# Altium project HeartBeat_v2.PrjPcb
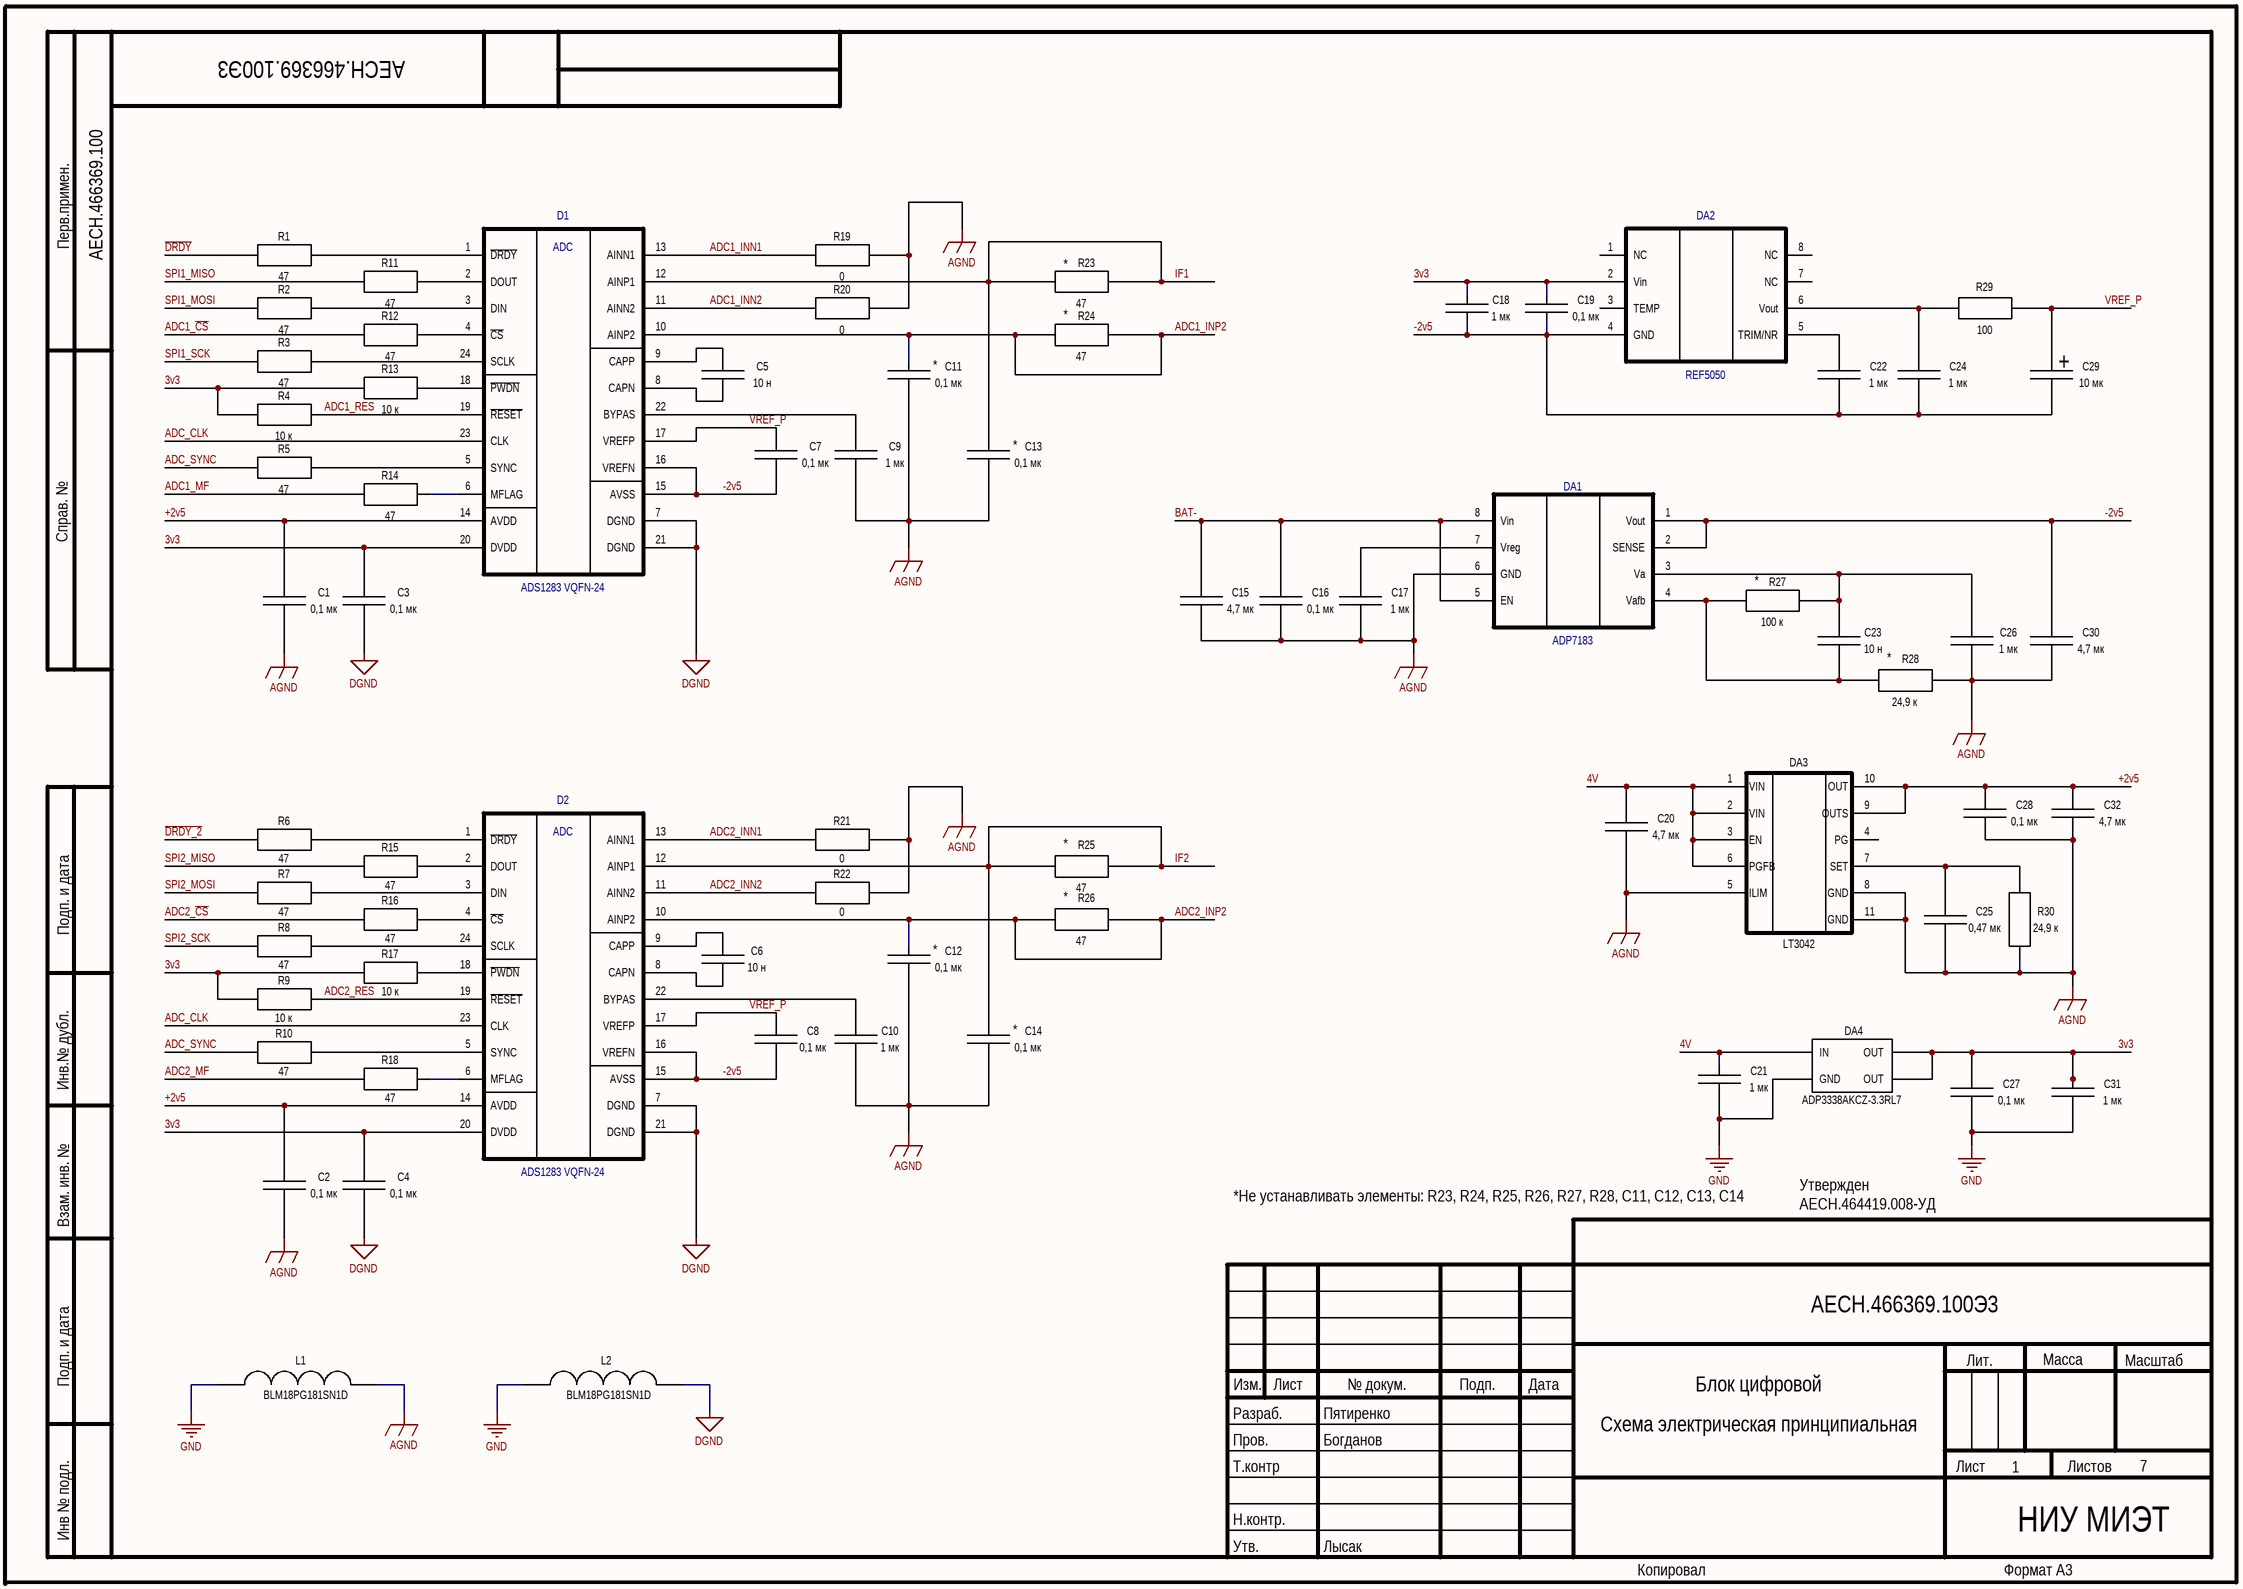
[diagram p0: ADC.SchDoc]
7 sheets, 223 parts. Net scope: global (net labels, ports and power ports of the same name join across sheets).
Board file: PCB1.PcbDoc
Sheets:
  ADC.SchDoc
  Connectors.SchDoc
  OTHER.SchDoc
  SDRAM.SchDoc
  MCU_1.SchDoc
  RES_ASSEMBLY.SchDoc
  MCU_Power.SchDoc

## Sheet ADC.SchDoc: Блок цифровой
size 420 x 297 mm; ApprovedBy: Лысак; CheckedBy: Богданов; Author: Пятиренко; CompanyName: нпг; DrawnBy: Человек; Organization: айцайц; DocumentNumber: АЕСН.466369.100Э3; SheetNumber: 1; SheetTotal: 7; PERVICH PRIM: АЕСН.466369.100; Title2: Схема электрическая принципиальная; DocumentName: Sheet1.SCHDOC; Application_BuildNumber: sdfsdfsdfsdfsdfs

### Parts
C1  value 0,1 мк  [C0603]  (hidden comment: C)
C2  value 0,1 мк  [C0603]  (hidden comment: C)
C3  value 0,1 мк  [C0603]  (hidden comment: C)
C4  value 0,1 мк  [C0603]  (hidden comment: C)
C5  value 10 н  [C0603]  (hidden comment: C)
C6  value 10 н  [C0603]  (hidden comment: C)
C7  value 0,1 мк  [C0603]  (hidden comment: C)
C8  value 0,1 мк  [C0603]  (hidden comment: C)
C9  value 1 мк  [C0603]  (hidden comment: C)
C10  value 1 мк  [C0603]  (hidden comment: C)
C11  value 0,1 мк  [C0603]  (hidden comment: C)
C12  value 0,1 мк  [C0603]  (hidden comment: C)
C13  value 0,1 мк  [C0603]  (hidden comment: C)
C14  value 0,1 мк  [C0603]  (hidden comment: C)
C15  value 4,7 мк  [C0603]  (hidden comment: C)
C16  value 0,1 мк  [C0603]  (hidden comment: C)
C17  value 1 мк  [C0603]  (hidden comment: C)
C18  value 1 мк  [C0603]  (hidden comment: C)
C19  value 0,1 мк  [C0603]  (hidden comment: C)
C20  value 4,7 мк  [C0603]  (hidden comment: C)
C21  value 1 мк  [C0603]  (hidden comment: C)
C22  value 1 мк  [C0603]  (hidden comment: C)
C23  value 10 н  [C0603]  (hidden comment: C)
C24  value 1 мк  [C0603]  (hidden comment: C)
C25  value 0,47 мк  [C0603]  (hidden comment: C)
C26  value 1 мк  [C0603]  (hidden comment: C)
C27  value 0,1 мк  [C0603]  (hidden comment: C)
C28  value 0,1 мк  [C0603]  (hidden comment: C)
C29  value 10 мк  [Case A]  (hidden comment: C_el)
C30  value 4,7 мк  [C0603]  (hidden comment: C)
C31  value 1 мк  [C0603]  (hidden comment: C)
C32  value 4,7 мк  [C0603]  (hidden comment: C)
D1  ADS1283 VQFN-24  [VQFN24_8x8x4x4]
D2  ADS1283 VQFN-24  [VQFN24_8x8x4x4]
DA1  ADP7183  [LFCSP-8]
DA2  REF5050  [SOIC8]
DA3  LT3042  [DFN-10 3x3]
DA4  ADP3338AKCZ-3.3RL7  [SOT-223]
L1  BLM18PG181SN1D  [INDC_0603]
L2  BLM18PG181SN1D  [INDC_0603]
R1  value 47  [R0603]  (hidden comment: R)
R2  value 47  [R0603]  (hidden comment: R)
R3  value 47  [R0603]  (hidden comment: R)
R4  value 10 к  [R0603]  (hidden comment: R)
R5  value 47  [R0603]  (hidden comment: R)
R6  value 47  [R0603]  (hidden comment: R)
R7  value 47  [R0603]  (hidden comment: R)
R8  value 47  [R0603]  (hidden comment: R)
R9  value 10 к  [R0603]  (hidden comment: R)
R10  value 47  [R0603]  (hidden comment: R)
R11  value 47  [R0603]  (hidden comment: R)
R12  value 47  [R0603]  (hidden comment: R)
R13  value 10 к  [R0603]  (hidden comment: R)
R14  value 47  [R0603]  (hidden comment: R)
R15  value 47  [R0603]  (hidden comment: R)
R16  value 47  [R0603]  (hidden comment: R)
R17  value 10 к  [R0603]  (hidden comment: R)
R18  value 47  [R0603]  (hidden comment: R)
R19  value 0  [R0603]  (hidden comment: R)
R20  value 0  [R0603]  (hidden comment: R)
R21  value 0  [R0603]  (hidden comment: R)
R22  value 0  [R0603]  (hidden comment: R)
R23  value 47  [R0603]  (hidden comment: R)
R24  value 47  [R0603]  (hidden comment: R)
R25  value 47  [R0603]  (hidden comment: R)
R26  value 47  [R0603]  (hidden comment: R)
R27  value 100 к  [R0603]  (hidden comment: R)
R28  value 24,9 к  [R0603]  (hidden comment: R)
R29  value 100  [R0603]  (hidden comment: R)
R30  value 24,9 к  [R0603]  (hidden comment: R)

### Nets
AGND: C1.2 C2.2 C9.2 C10.2 C11.2 C12.2 C13.2 C14.2 C15.2 C16.2 C17.2 C20.2 C25.2 C26.2 C28.2 C30.2 C32.2 DA1.6(GND) DA3.5(ILIM) DA3.8(GND) DA3.11(GND) L1.1 R19.2 R20.2 R21.2 R22.2 R28.2 R30.1
DGND: C3.2 C4.2 D1.7(DGND) D1.21(DGND) D2.7(DGND) D2.21(DGND) L2.1
GND: C21.2 C27.2 C31.2 DA4.1(GND) L1.2 L2.2
3v3: C3.1 C4.1 C18.1 C19.1 C27.1 C31.1 D1.20(DVDD) D2.20(DVDD) DA2.2(Vin) DA4.2(OUT) DA4.4(OUT) R4.1 R9.1 R13.1 R17.1
4V: C20.1 C21.1 DA3.1(VIN) DA3.2(VIN) DA3.3(EN) DA3.6(PGFB) DA4.3(IN)
+2v5: C1.1 C2.1 C28.1 C32.1 D1.14(AVDD) D2.14(AVDD) DA3.9(OUTS) DA3.10(OUT)
-2v5: C7.2 C8.2 C18.2 C19.2 C22.2 C24.2 C29.2 C30.1 D1.15(AVSS) D1.16(VREFN) D2.15(AVSS) D2.16(VREFN) DA1.1(Vout) DA1.2(SENSE) DA2.4(GND)
ADC1_~{CS}: R12.1
ADC1_INN1: D1.13(AINN1) R19.1
ADC1_INN2: D1.11(AINN2) R20.1
ADC1_INP2: C11.1 D1.10(AINP2) R24.1 R24.2
ADC1_MF: R14.1
ADC1_RES: D1.19(~{RESET}) R4.2
ADC2_~{CS}: R16.1
ADC2_INN1: D2.13(AINN1) R21.1
ADC2_INN2: D2.11(AINN2) R22.1
ADC2_INP2: C12.1 D2.10(AINP2) R26.1 R26.2
ADC2_MF: R18.1
ADC2_RES: D2.19(~{RESET}) R9.2
ADC_CLK: D1.23(CLK) D2.23(CLK)
ADC_SYNC: R5.1 R10.1
BAT-: C15.1 C16.1 DA1.5(EN) DA1.8(Vin)
~{DRDY}: R1.1
~{DRDY_2}: R6.1
IF1: C13.1 D1.12(AINP1) R23.1 R23.2
IF2: C14.1 D2.12(AINP1) R25.1 R25.2
SPI1_MISO: R11.1
SPI1_MOSI: R2.1
SPI1_SCK: R3.1
SPI2_MISO: R15.1
SPI2_MOSI: R7.1
SPI2_SCK: R8.1
VREF_P: C7.1 C8.1 C29.1 D1.17(VREFP) D2.17(VREFP) R29.2
NetC5_1: C5.1 D1.8(CAPN)
NetC5_2: C5.2 D1.9(CAPP)
NetC6_1: C6.1 D2.8(CAPN)
NetC6_2: C6.2 D2.9(CAPP)
NetC9_1: C9.1 D1.22(BYPAS)
NetC10_1: C10.1 D2.22(BYPAS)
NetC17_1: C17.1 DA1.7(Vreg)
NetC22_1: C22.1 DA2.5(TRIM/NR)
NetC23_1: C23.1 DA1.4(Vafb) R27.1 R28.1
NetC23_2: C23.2 C26.1 DA1.3(Va) R27.2
NetC24_1: C24.1 DA2.6(Vout) R29.1
NetC25_1: C25.1 DA3.7(SET) R30.2
NetD1_1: D1.1(~{DRDY}) R1.2
NetD1_2: D1.2(DOUT) R11.2
NetD1_3: D1.3(DIN) R2.2
NetD1_4: D1.4(~{CS}) R12.2
NetD1_5: D1.5(SYNC) R5.2
NetD1_6: D1.6(MFLAG) R14.2
NetD1_18: D1.18(~{PWDN}) R13.2
NetD1_24: D1.24(SCLK) R3.2
NetD2_1: D2.1(~{DRDY}) R6.2
NetD2_2: D2.2(DOUT) R15.2
NetD2_3: D2.3(DIN) R7.2
NetD2_4: D2.4(~{CS}) R16.2
NetD2_5: D2.5(SYNC) R10.2
NetD2_6: D2.6(MFLAG) R18.2
NetD2_18: D2.18(~{PWDN}) R17.2
NetD2_24: D2.24(SCLK) R8.2

Not connected (* = marked no-connect by the designer): DA2 1(NC) 3(TEMP) 7(NC) 8(NC); DA3 4(PG)

### Notes on the sheet
- (near R23) *
- (near R24) *
- (near C11) *
- (near C13) *
- (near R27) *
- (near R28) *
- (near R25) *
- *
- (near C12) *
- (near C14) *
- *Не устанавливать элементы: R23, R24, R25, R26, R27, R28, C11, C12, C13, C14
- Утвержден
- АЕСН.464419.008-УД
- НИУ МИЭТ
- Перв.примен.
- Справ. №
- Подп. и дата
- Инв.№ дубл.
- Взам. инв. №
- Изм.
- Лист
- № докум.
- Подп.
- Дата
- Лит.
- Масса
- Масштаб
- Пров.
- Т.контр
- Разраб.
- Листов
- Инв № подл.
- Н.контр.
- Утв.
- Копировал
- Формат А3
- (in symbol ADS1283) ADC
- (in symbol C_el) +

### Library data of the parts
C1-C4 C7 C8 C11-C14 C16 C19 C27 C28 = C: PartNumber: GRM188R71H104KA93D; Tolerance: ±10%; Voltage: 50 В; Dielectric: X7R; Case: 0603
  C1-C4 C7 C8 C16 C19 C27 C28: Mount: *
C5 C6 C23 = C: PartNumber: GRM188R72A103KA01J; Tolerance: ±10%; Voltage: 100В; Dielectric: X7R; Case: 0603; Mount: *
C9 C10 C17 C18 C21 C22 C24 C26 C31 = C: PartNumber: GRM188R71E105KA12D; Tolerance: ±10%; Voltage: 25 В; Dielectric: X7R; Case: 0603; Mount: *
C15 C20 C30 C32 = C: PartNumber: GRM188Z71C475KE21D; Tolerance: ±10%; Voltage: 16 В; Dielectric: X7R; Case: 0603; Mount: *
C25 = C: PartNumber: GRM188R71E474KA12D; Tolerance: ±10%; Voltage: 25 В; Dielectric: X7R; Case: 0603; Mount: *
C29 = C_el: PartNumber: TAJA106K016RNJ; Tolerance: ±10%; Voltage: 16 V; Dielectric: *; Case: "A"; Mount: *
D1 D2 = ADS1283: ADC 2ch
DA2 = REF50xx
DA4 = LD1117S33
L1 L2 = L_1
R1-R3 R5-R8 R10-R12 R14-R16 R18 R23-R26 = R: PartNumber: RC0603JR-0747RL; Tolerance: ±5%; Power: 0.1 Вт; Case: 0603
R4 R9 R13 R17 = R: PartNumber: RC0603JR-0710KL; Tolerance: ±5%; Power: 0.1 Вт; Case: 0603
R19-R22 = R: PartNumber: RC0603JR-070RL; Tolerance: ±5%; Power: 0.1 Вт; Case: 0603
R27 = R: PartNumber: RC0603FR-07100KL; Tolerance: ±1%; Power: 0.1 Вт; Case: 0603
R28 R30 = R: PartNumber: RC0603FR-0724K9L; Tolerance: ±1%; Power: 0.1 Вт; Case: 0603
R29 = R: PartNumber: RC0603JR-07100RL; Tolerance: ±5%; Power: 0.1 Вт; Case: 0603

## Sheet Connectors.SchDoc
size 420 x 297 mm; DocumentNumber: АЕСН.466369.100Э3; SheetNumber: 2; SheetTotal: x; DocumentName: Sheet1.SCHDOC
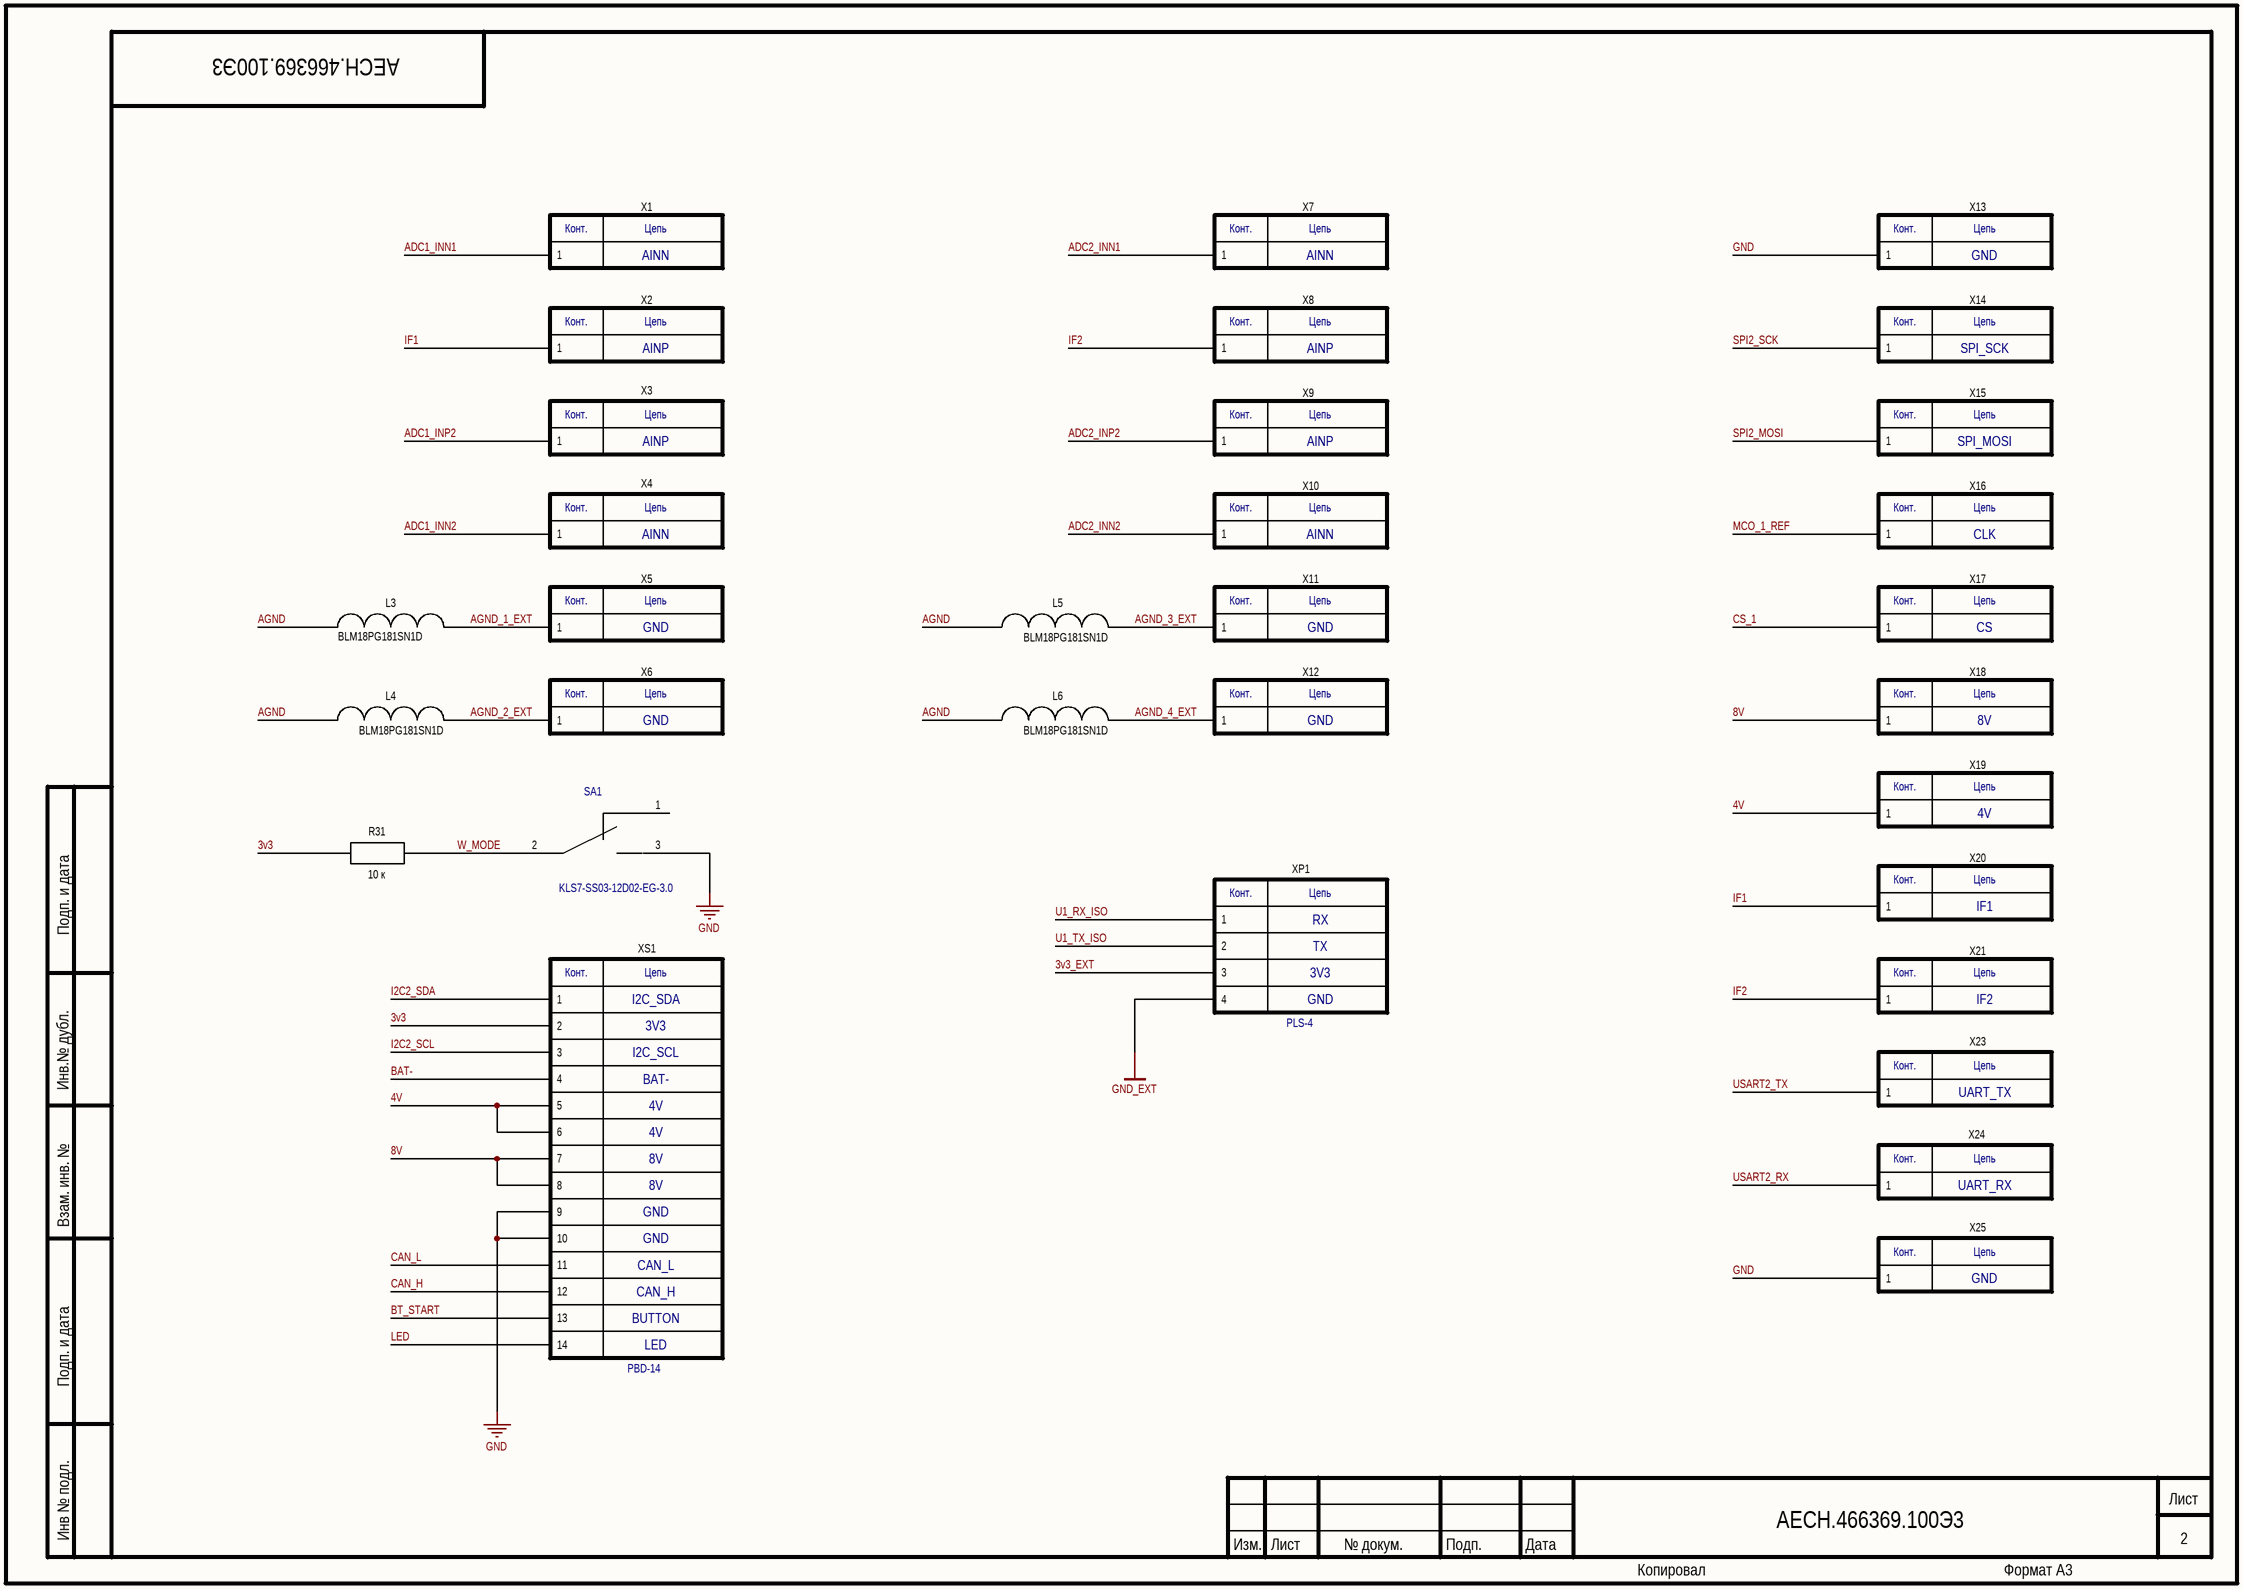
[diagram p1: Connectors.SchDoc]

### Parts
L3  BLM18PG181SN1D  [INDC_0603]
L4  BLM18PG181SN1D  [INDC_0603]
L5  BLM18PG181SN1D  [INDC_0603]
L6  BLM18PG181SN1D  [INDC_0603]
R31  value 10 к  [R0603]  (hidden comment: R)
SA1  PartNumber: KLS7-SS03-12D02-EG-3.0  [KLS7-SS03-12D02]  (hidden comment: Switch)
X1  1pin  [lam 4x2]  (value not drawn)
X2  1pin  [lam 4x2]  (value not drawn)
X3  1pin  [lam 4x2]  (value not drawn)
X4  1pin  [lam 4x2]  (value not drawn)
X5  1pin  [lam 4x2]  (value not drawn)
X6  1pin  [lam 4x2]  (value not drawn)
X7  1pin  [lam 4x2]  (value not drawn)
X8  1pin  [lam 4x2]  (value not drawn)
X9  1pin  [lam 4x2]  (value not drawn)
X10  1pin  [lam 4x2]  (value not drawn)
X11  1pin  [lam 4x2]  (value not drawn)
X12  1pin  [lam 4x2]  (value not drawn)
X13  1pin  [lam 4x2]  (value not drawn)
X14  1pin  [lam 4x2]  (value not drawn)
X15  1pin  [lam 4x2]  (value not drawn)
X16  1pin  [lam 4x2]  (value not drawn)
X17  1pin  [lam 4x2]  (value not drawn)
X18  1pin  [lam 4x2]  (value not drawn)
X19  1pin  [lam 4x2]  (value not drawn)
X20  1pin  [lam 4x2]  (value not drawn)
X21  1pin  [lam 4x2]  (value not drawn)
X23  1pin  [lam 4x2]  (value not drawn)
X24  1pin  [lam 4x2]  (value not drawn)
X25  1pin  [lam 4x2]  (value not drawn)
XP1  4pin  [PLS-4]  (value not drawn)
XS1  14pin  [PBD-14]  (value not drawn)

### Nets
AGND: L3.2 L4.2 L5.2 L6.2
GND: SA1.3 X13.1 X25.1 XS1.9 XS1.10
GND_EXT: XP1.4
3v3: R31.1 XS1.2
3v3_EXT: XP1.3
4V: X19.1 XS1.5 XS1.6
8V: X18.1 XS1.7 XS1.8
ADC1_INN1: X1.1
ADC1_INN2: X4.1
ADC1_INP2: X3.1
ADC2_INN1: X7.1
ADC2_INN2: X10.1
ADC2_INP2: X9.1
AGND_1_EXT: L3.1 X5.1
AGND_2_EXT: L4.1 X6.1
AGND_3_EXT: L5.1 X11.1
AGND_4_EXT: L6.1 X12.1
BAT-: XS1.4
BT_START: XS1.13
CAN_H: XS1.12
CAN_L: XS1.11
CS_1: X17.1
I2C2_SCL: XS1.3
I2C2_SDA: XS1.1
IF1: X2.1 X20.1
IF2: X8.1 X21.1
LED: XS1.14
MCO_1_REF: X16.1
SPI2_MOSI: X15.1
SPI2_SCK: X14.1
U1_RX_ISO: XP1.1
U1_TX_ISO: XP1.2
USART2_RX: X24.1
USART2_TX: X23.1
W_MODE: R31.2 SA1.2

Not connected (* = marked no-connect by the designer): SA1 1

### Notes on the sheet
- AINN
- GND
- AINP
- SPI_SCK
- SPI_MOSI
- CLK
- CS
- 8V
- 4V
- RX
- IF1
- I2C_SDA
- TX
- 3V3
- IF2
- I2C_SCL
- BAT-
- UART_TX
- UART_RX
- CAN_L
- CAN_H
- BUTTON
- LED
- Подп. и дата
- Инв.№ дубл.
- Взам. инв. №
- Инв № подл.
- Изм.
- Лист
- № докум.
- Подп.
- Дата
- Копировал
- Формат А3
- (in symbol 1pin) Конт.; Цепь
- (in symbol 4pin) Конт.; Цепь
- (in symbol 14pin) Конт.; Цепь

### Library data of the parts
L3-L6 = L_1
R31 = R: as R4 on sheet ADC; Case: 0603
SA1 = Switch: Manufacturer: *
X1-X21 X23-X25 = 1pin: Manufacturer: *; PartNumber: *
XP1 = 4pin: Manufacturer: *; PartNumber: PLS-4
XS1 = 14pin: Manufacturer: *; PartNumber: PBD-14

## Sheet OTHER.SchDoc
size 420 x 297 mm; DocumentNumber: АЕСН.466369.100Э3; SheetNumber: 3; SheetTotal: x; DocumentName: Sheet1.SCHDOC
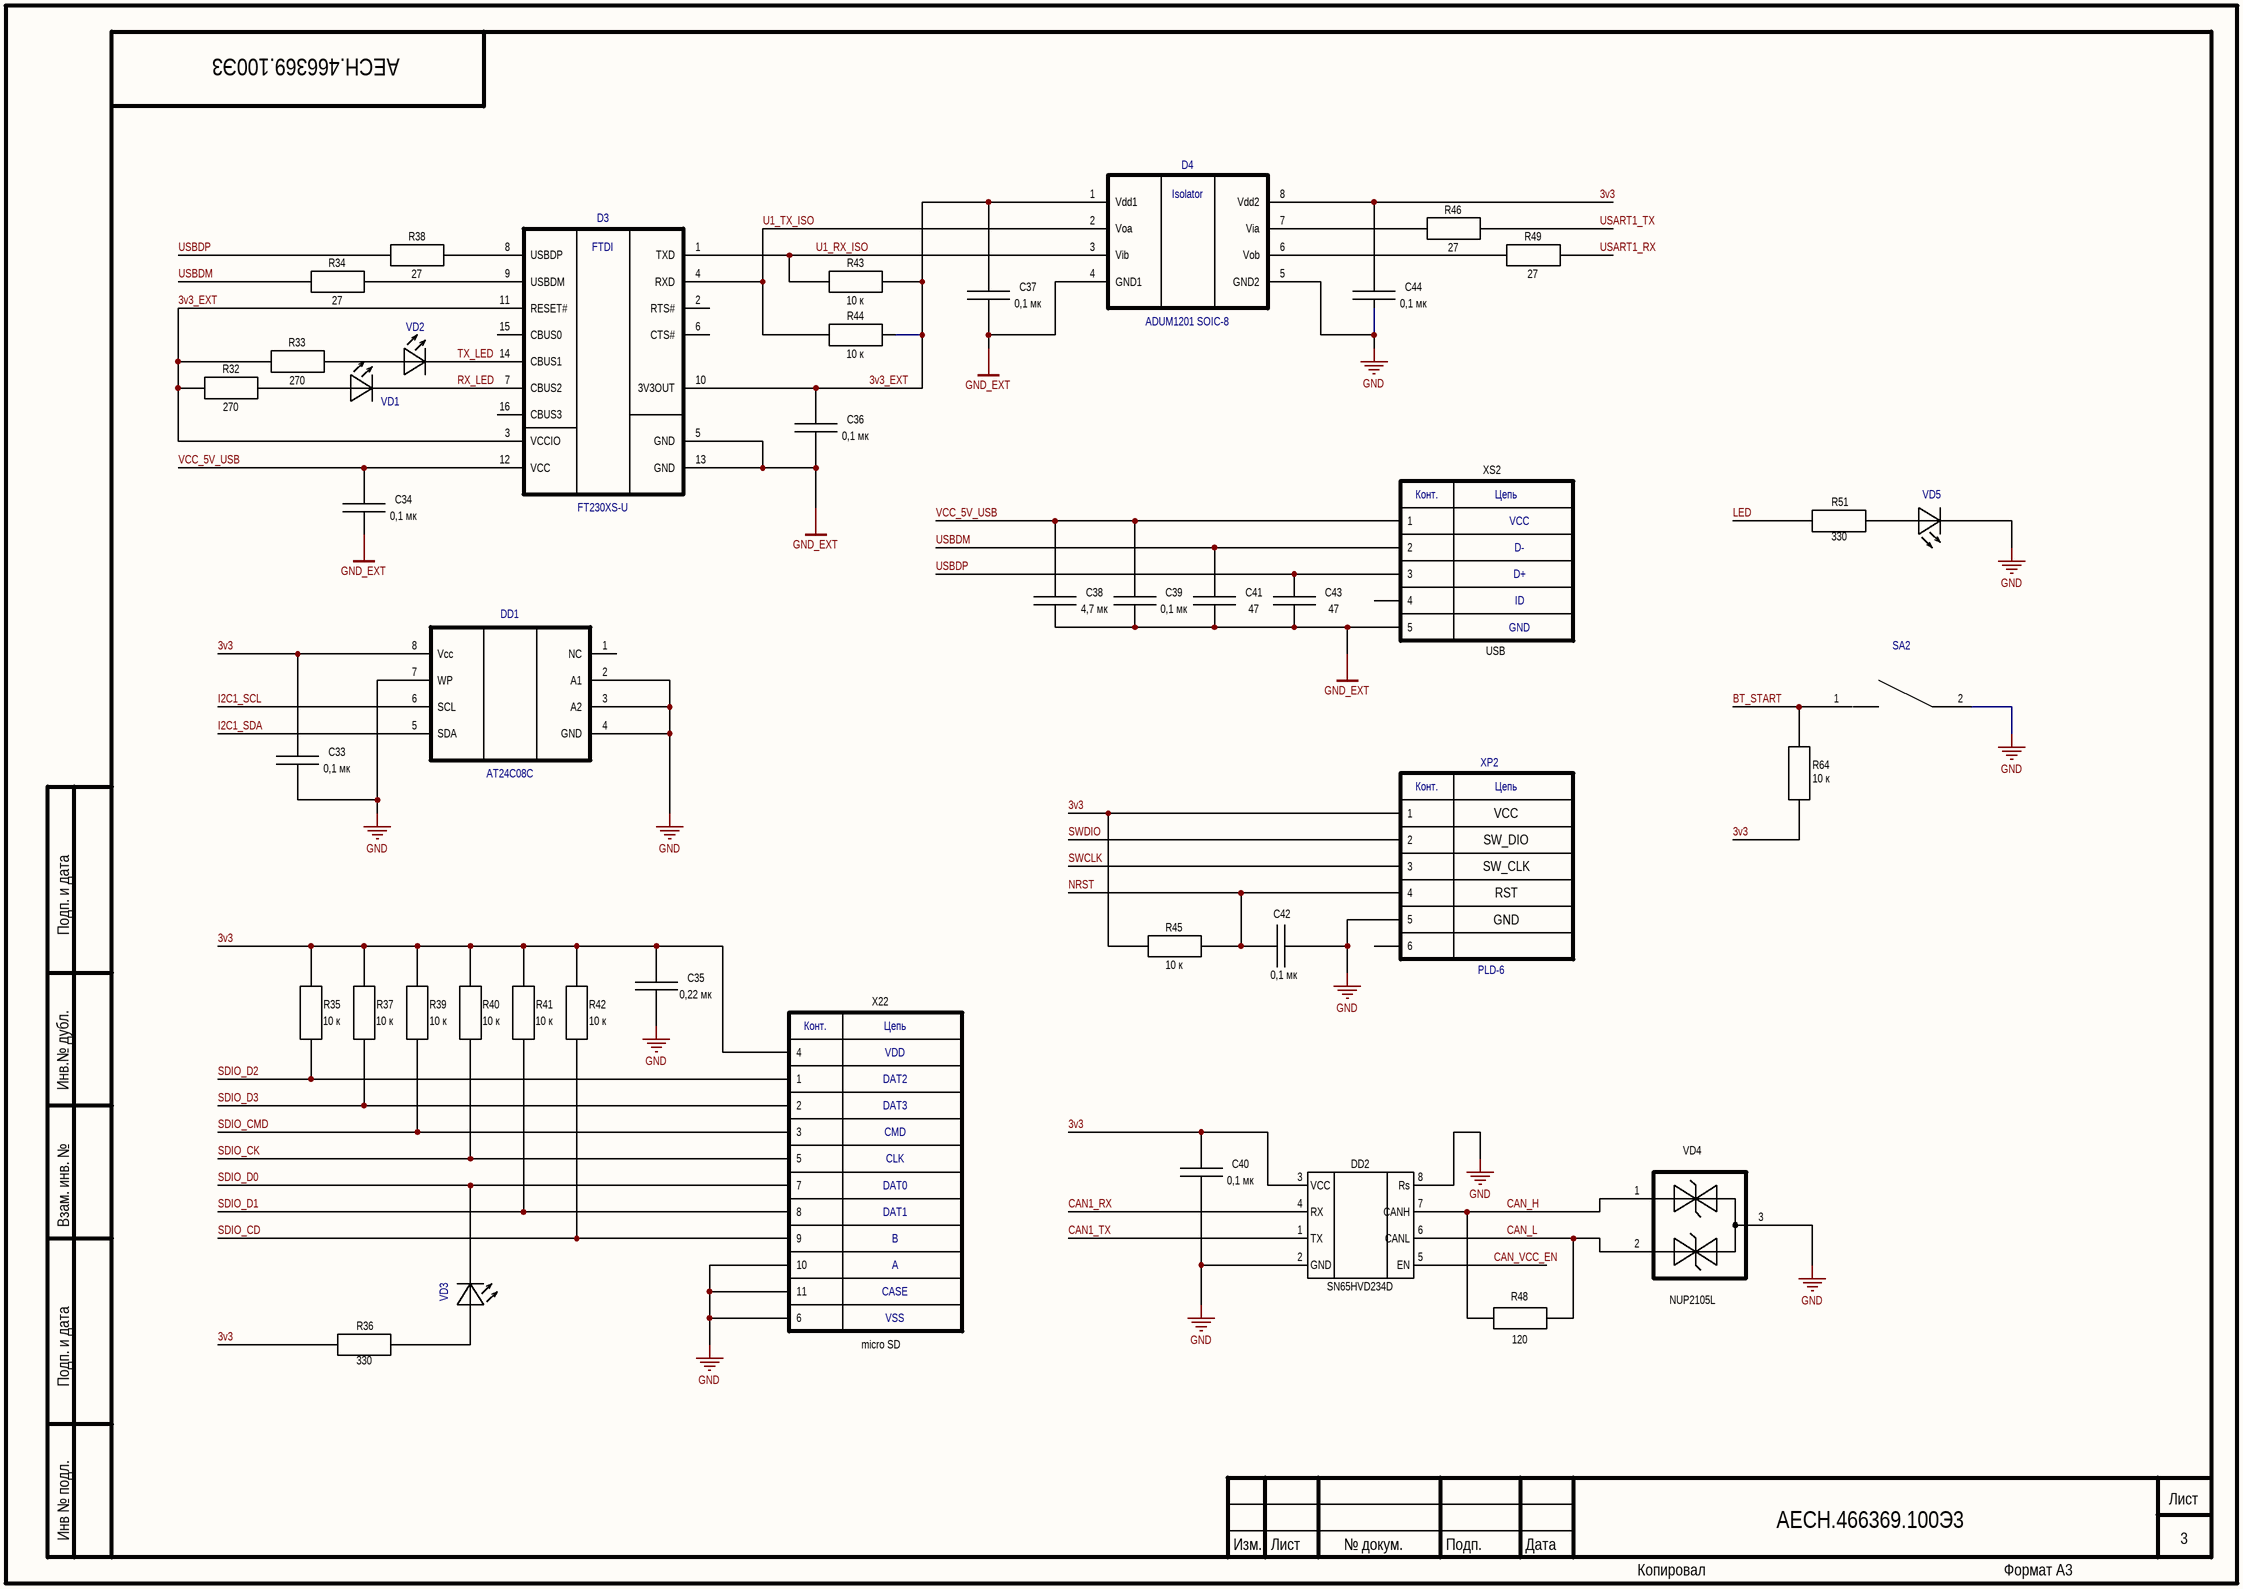
[diagram p2: OTHER.SchDoc]

### Parts
C33  value 0,1 мк  [C0603]  (hidden comment: C)
C34  value 0,1 мк  [C0603]  (hidden comment: C)
C35  value 0,22 мк  [C0603]  (hidden comment: C)
C36  value 0,1 мк  [C0603]  (hidden comment: C)
C37  value 0,1 мк  [C0603]  (hidden comment: C)
C38  value 4,7 мк  [C0603]  (hidden comment: C)
C39  value 0,1 мк  [C0603]  (hidden comment: C)
C40  value 0,1 мк  [C0603]  (hidden comment: C)
C41  value 47  [C0603]  (hidden comment: C)
C42  value 0,1 мк  [C0603]  (hidden comment: C)
C43  value 47  [C0603]  (hidden comment: C)
C44  value 0,1 мк  [C0603]  (hidden comment: C)
D3  FT230XS-U  [SSOP-16]
D4  ADUM1201 SOIC-8  [SOIC8]
DD1  AT24C08C  [SOIC8]
DD2  SN65HVD234D  [SOIC8]
R32  value 270  [R0603]  (hidden comment: R)
R33  value 270  [R0603]  (hidden comment: R)
R34  value 27  [R0603]  (hidden comment: R)
R35  value 10 к  [R0603]  (hidden comment: R)
R36  value 330  [R0603]  (hidden comment: R)
R37  value 10 к  [R0603]  (hidden comment: R)
R38  value 27  [R0603]  (hidden comment: R)
R39  value 10 к  [R0603]  (hidden comment: R)
R40  value 10 к  [R0603]  (hidden comment: R)
R41  value 10 к  [R0603]  (hidden comment: R)
R42  value 10 к  [R0603]  (hidden comment: R)
R43  value 10 к  [R0603]  (hidden comment: R)
R44  value 10 к  [R0603]  (hidden comment: R)
R45  value 10 к  [R0603]  (hidden comment: R)
R46  value 27  [R0603]  (hidden comment: R)
R48  value 120  [R1206]  (hidden comment: R)
R49  value 27  [R0603]  (hidden comment: R)
R51  value 330  [R0603]  (hidden comment: R)
R64  value 10 к  [R0603]  (hidden comment: R)
SA2  Button  [KLS7_6x6]  (value not drawn)
VD1  LED  [LED_0603_YELLOW]  (value not drawn)
VD2  LED  [LED_0603_GREEN]  (value not drawn)
VD3  LED  [LED_0603_BLUE]  (value not drawn)
VD4  NUP2105L  [SOT-23]
VD5  LED  [LED_0603_RED]  (value not drawn)
X22  micro SD  [DM3AT-SF-PEJM5]
XP2  PLD-6  [PLD-6]
XS2  USB  [USB_MICRO_1981568-1]

### Nets
GND: C33.2 C35.2 C40.2 C42.2 C44.2 D4.5(GND2) DD1.2(A1) DD1.3(A2) DD1.4(GND) DD1.7(WP) DD2.2(GND) DD2.8(Rs) SA2.2 VD4.3(AC) VD5.2(C) X22.6 X22.10 X22.11 XP2.5
GND_EXT: C34.2 C36.2 C37.2 C38.2 C39.2 C41.2 C43.2 D3.5(GND) D3.13(GND) D4.4(GND1) XS2.5
3v3: C33.1 C35.1 C40.1 C44.1 D4.8(Vdd2) DD1.8(Vcc) DD2.3(VCC) R35.2 R36.2 R37.2 R39.2 R40.2 R41.2 R42.2 R45.1 R64.1 X22.4 XP2.1
3v3_EXT: C36.1 C37.1 D3.3(VCCIO) D3.10(3V3OUT) D3.11(RESET#) D4.1(Vdd1) R32.1 R33.1 R43.2 R44.2
BT_START: R64.2 SA2.1
CAN1_RX: DD2.4(RX)
CAN1_TX: DD2.1(TX)
CAN_H: DD2.7(CANH) R48.1 VD4.1(A)
CAN_L: DD2.6(CANL) R48.2 VD4.2(C)
CAN_VCC_EN: DD2.5(EN)
I2C1_SCL: DD1.6(SCL)
I2C1_SDA: DD1.5(SDA)
LED: R51.2
NRST: C42.1 R45.2 XP2.4
RX_LED: D3.7(CBUS2) VD1.2(C)
SDIO_CD: R42.1 X22.9
SDIO_CK: R40.1 X22.5
SDIO_CMD: R39.1 X22.3
SDIO_D0: VD3.2(C) X22.7
SDIO_D1: R41.1 X22.8
SDIO_D2: R35.1 X22.1
SDIO_D3: R37.1 X22.2
SWCLK: XP2.3
SWDIO: XP2.2
TX_LED: D3.14(CBUS1) VD2.2(C)
U1_RX_ISO: D3.1(TXD) D4.3(Vib) R43.1
U1_TX_ISO: D3.4(RXD) D4.2(Voa) R44.1
USART1_RX: R49.2
USART1_TX: R46.2
USBDM: C41.1 R34.1 XS2.2
USBDP: C43.1 R38.1 XS2.3
VCC_5V_USB: C34.1 C38.1 C39.1 D3.12(VCC) XS2.1
NetD3_8: D3.8(USBDP) R38.2
NetD3_9: D3.9(USBDM) R34.2
NetD4_6: D4.6(Vob) R49.1
NetD4_7: D4.7(Via) R46.1
NetR32_2: R32.2 VD1.1(A)
NetR33_2: R33.2 VD2.1(A)
NetR36_1: R36.1 VD3.1(A)
NetR51_1: R51.1 VD5.1(A)

Not connected (* = marked no-connect by the designer): D3 2(RTS#) 6(CTS#) 15(CBUS0) 16(CBUS3); DD1 1(NC); XP2 6; XS2 4

### Notes on the sheet
- VCC
- SW_DIO
- SW_CLK
- RST
- GND
- Подп. и дата
- Инв.№ дубл.
- Взам. инв. №
- Инв № подл.
- Изм.
- Лист
- № докум.
- Подп.
- Дата
- Копировал
- Формат А3
- (in symbol 6pin) Конт.; Цепь
- (in symbol ADUM1201) Isolator
- (in symbol FT230XS-U) FTDI
- (in symbol microSD) Конт.; Цепь; VDD; DAT2; DAT3; CMD; CLK; DAT0; DAT1; B; A; CASE; VSS
- (in symbol USB) Конт.; Цепь; VCC; D-; D+; ID; GND

### Library data of the parts
C33 C34 C36 C37 C39 C40 C42 C44 = C: as C1 on sheet ADC; Case: 0603; Mount: *
C35 = C: PartNumber: GRM188R71E224KA88D; Tolerance: ±10%; Voltage: 25 В; Dielectric: X7R; Case: 0603; Mount: *
C38 = C: as C15 on sheet ADC; Case: 0603; Mount: *
C41 C43 = C: PartNumber: GRM1885C1H470FA01D; Tolerance: ±10%; Voltage: 50 В; Dielectric: NP0; Case: 0603; Mount: *
D4 = ADUM1201
DD1 = AT24C0xC
DD2 = SN65HVD234D: CAN
R32 R33 = R: PartNumber: RC0603JR-07270RL; Tolerance: ±5%; Power: 0.1 Вт; Case: 0603
R34 R38 R46 R49 = R: PartNumber: RC0603JR-0727RL; Tolerance: ±5%; Power: 0.1 Вт; Case: 0603
R35 R37 R39-R45 R64 = R: as R4 on sheet ADC; Case: 0603
R36 R51 = R: PartNumber: RC0603JR-07330RL; Tolerance: ±5%; Power: 0.1 Вт; Case: 0603
R48 = R: PartNumber: RC1206JR-13120RL; Tolerance: ±5%; Power: 0.25 Вт; Case: 1206
X22 = microSD
XP2 = 6pin: Manufacturer: *; PartNumber: PLD-6

## Sheet SDRAM.SchDoc
size 420 x 297 mm; DocumentNumber: АЕСН.466369.100Э3; SheetNumber: 4; SheetTotal: x; DocumentName: Sheet1.SCHDOC
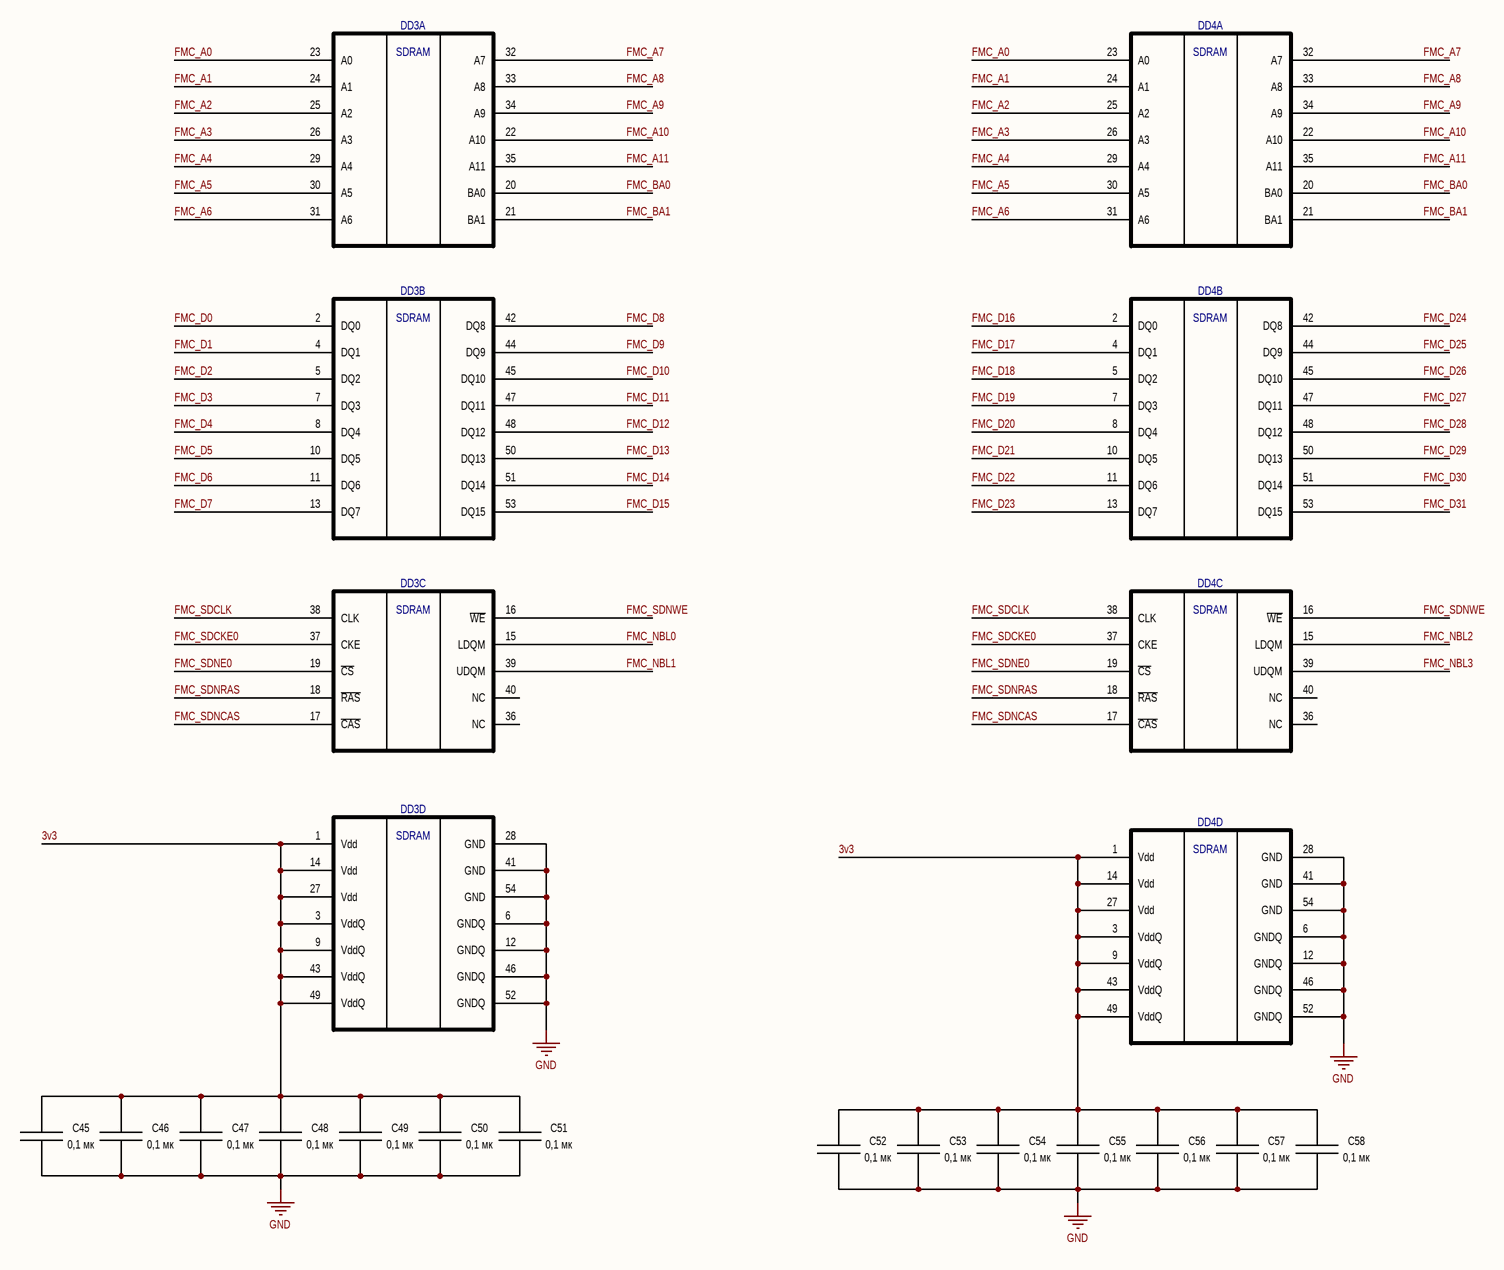
[diagram p3: SDRAM.SchDoc]

### Parts
C45  value 0,1 мк  [C0603]  (hidden comment: C)
C46  value 0,1 мк  [C0603]  (hidden comment: C)
C47  value 0,1 мк  [C0603]  (hidden comment: C)
C48  value 0,1 мк  [C0603]  (hidden comment: C)
C49  value 0,1 мк  [C0603]  (hidden comment: C)
C50  value 0,1 мк  [C0603]  (hidden comment: C)
C51  value 0,1 мк  [C0603]  (hidden comment: C)
C52  value 0,1 мк  [C0603]  (hidden comment: C)
C53  value 0,1 мк  [C0603]  (hidden comment: C)
C54  value 0,1 мк  [C0603]  (hidden comment: C)
C55  value 0,1 мк  [C0603]  (hidden comment: C)
C56  value 0,1 мк  [C0603]  (hidden comment: C)
C57  value 0,1 мк  [C0603]  (hidden comment: C)
C58  value 0,1 мк  [C0603]  (hidden comment: C)
DD3  IS42S16400J  [TSOP-54]  (value not drawn)  (parts A,B,C,D of 4)
DD4  IS42S16400J  [TSOP-54]  (value not drawn)  (parts A,B,C,D of 4)

### Nets
GND: C45.2 C46.2 C47.2 C48.2 C49.2 C50.2 C51.2 C52.2 C53.2 C54.2 C55.2 C56.2 C57.2 C58.2 DD3.6(GNDQ) DD3.12(GNDQ) DD3.28(GND) DD3.41(GND) DD3.46(GNDQ) DD3.52(GNDQ) DD3.54(GND) DD4.6(GNDQ) DD4.12(GNDQ) DD4.28(GND) DD4.41(GND) DD4.46(GNDQ) DD4.52(GNDQ) DD4.54(GND)
3v3: C45.1 C46.1 C47.1 C48.1 C49.1 C50.1 C51.1 C52.1 C53.1 C54.1 C55.1 C56.1 C57.1 C58.1 DD3.1(Vdd) DD3.3(VddQ) DD3.9(VddQ) DD3.14(Vdd) DD3.27(Vdd) DD3.43(VddQ) DD3.49(VddQ) DD4.1(Vdd) DD4.3(VddQ) DD4.9(VddQ) DD4.14(Vdd) DD4.27(Vdd) DD4.43(VddQ) DD4.49(VddQ)
FMC_A0: DD3.23(A0) DD4.23(A0)
FMC_A1: DD3.24(A1) DD4.24(A1)
FMC_A2: DD3.25(A2) DD4.25(A2)
FMC_A3: DD3.26(A3) DD4.26(A3)
FMC_A4: DD3.29(A4) DD4.29(A4)
FMC_A5: DD3.30(A5) DD4.30(A5)
FMC_A6: DD3.31(A6) DD4.31(A6)
FMC_A7: DD3.32(A7) DD4.32(A7)
FMC_A8: DD3.33(A8) DD4.33(A8)
FMC_A9: DD3.34(A9) DD4.34(A9)
FMC_A10: DD3.22(A10) DD4.22(A10)
FMC_A11: DD3.35(A11) DD4.35(A11)
FMC_BA0: DD3.20(BA0) DD4.20(BA0)
FMC_BA1: DD3.21(BA1) DD4.21(BA1)
FMC_D0: DD3.2(DQ0)
FMC_D1: DD3.4(DQ1)
FMC_D2: DD3.5(DQ2)
FMC_D3: DD3.7(DQ3)
FMC_D4: DD3.8(DQ4)
FMC_D5: DD3.10(DQ5)
FMC_D6: DD3.11(DQ6)
FMC_D7: DD3.13(DQ7)
FMC_D8: DD3.42(DQ8)
FMC_D9: DD3.44(DQ9)
FMC_D10: DD3.45(DQ10)
FMC_D11: DD3.47(DQ11)
FMC_D12: DD3.48(DQ12)
FMC_D13: DD3.50(DQ13)
FMC_D14: DD3.51(DQ14)
FMC_D15: DD3.53(DQ15)
FMC_D16: DD4.2(DQ0)
FMC_D17: DD4.4(DQ1)
FMC_D18: DD4.5(DQ2)
FMC_D19: DD4.7(DQ3)
FMC_D20: DD4.8(DQ4)
FMC_D21: DD4.10(DQ5)
FMC_D22: DD4.11(DQ6)
FMC_D23: DD4.13(DQ7)
FMC_D24: DD4.42(DQ8)
FMC_D25: DD4.44(DQ9)
FMC_D26: DD4.45(DQ10)
FMC_D27: DD4.47(DQ11)
FMC_D28: DD4.48(DQ12)
FMC_D29: DD4.50(DQ13)
FMC_D30: DD4.51(DQ14)
FMC_D31: DD4.53(DQ15)
FMC_NBL0: DD3.15(LDQM)
FMC_NBL1: DD3.39(UDQM)
FMC_NBL2: DD4.15(LDQM)
FMC_NBL3: DD4.39(UDQM)
FMC_SDCKE0: DD3.37(CKE) DD4.37(CKE)
FMC_SDCLK: DD3.38(CLK) DD4.38(CLK)
FMC_SDNCAS: DD3.17(~{CAS}) DD4.17(~{CAS})
FMC_SDNE0: DD3.19(~{CS}) DD4.19(~{CS})
FMC_SDNRAS: DD3.18(~{RAS}) DD4.18(~{RAS})
FMC_SDNWE: DD3.16(~{WE}) DD4.16(~{WE})

Not connected (* = marked no-connect by the designer): DD3 36(NC) 40(NC); DD4 36(NC) 40(NC)

### Notes on the sheet
- Подп. и дата
- Инв.№ дубл.
- Взам. инв. №
- Инв № подл.
- Изм.
- Лист
- № докум.
- Подп.
- Дата
- Копировал
- Формат А3
- (in symbol IS42S16400J, part A) SDRAM
- (in symbol IS42S16400J, part B) SDRAM
- (in symbol IS42S16400J, part C) SDRAM
- (in symbol IS42S16400J, part D) SDRAM

### Library data of the parts
C45-C58 = C: as C1 on sheet ADC; Case: 0603; Mount: *

## Sheet MCU_1.SchDoc
size 420 x 297 mm; DocumentNumber: АЕСН.466369.100Э3; SheetNumber: 5; SheetTotal: x; DocumentName: Sheet1.SCHDOC
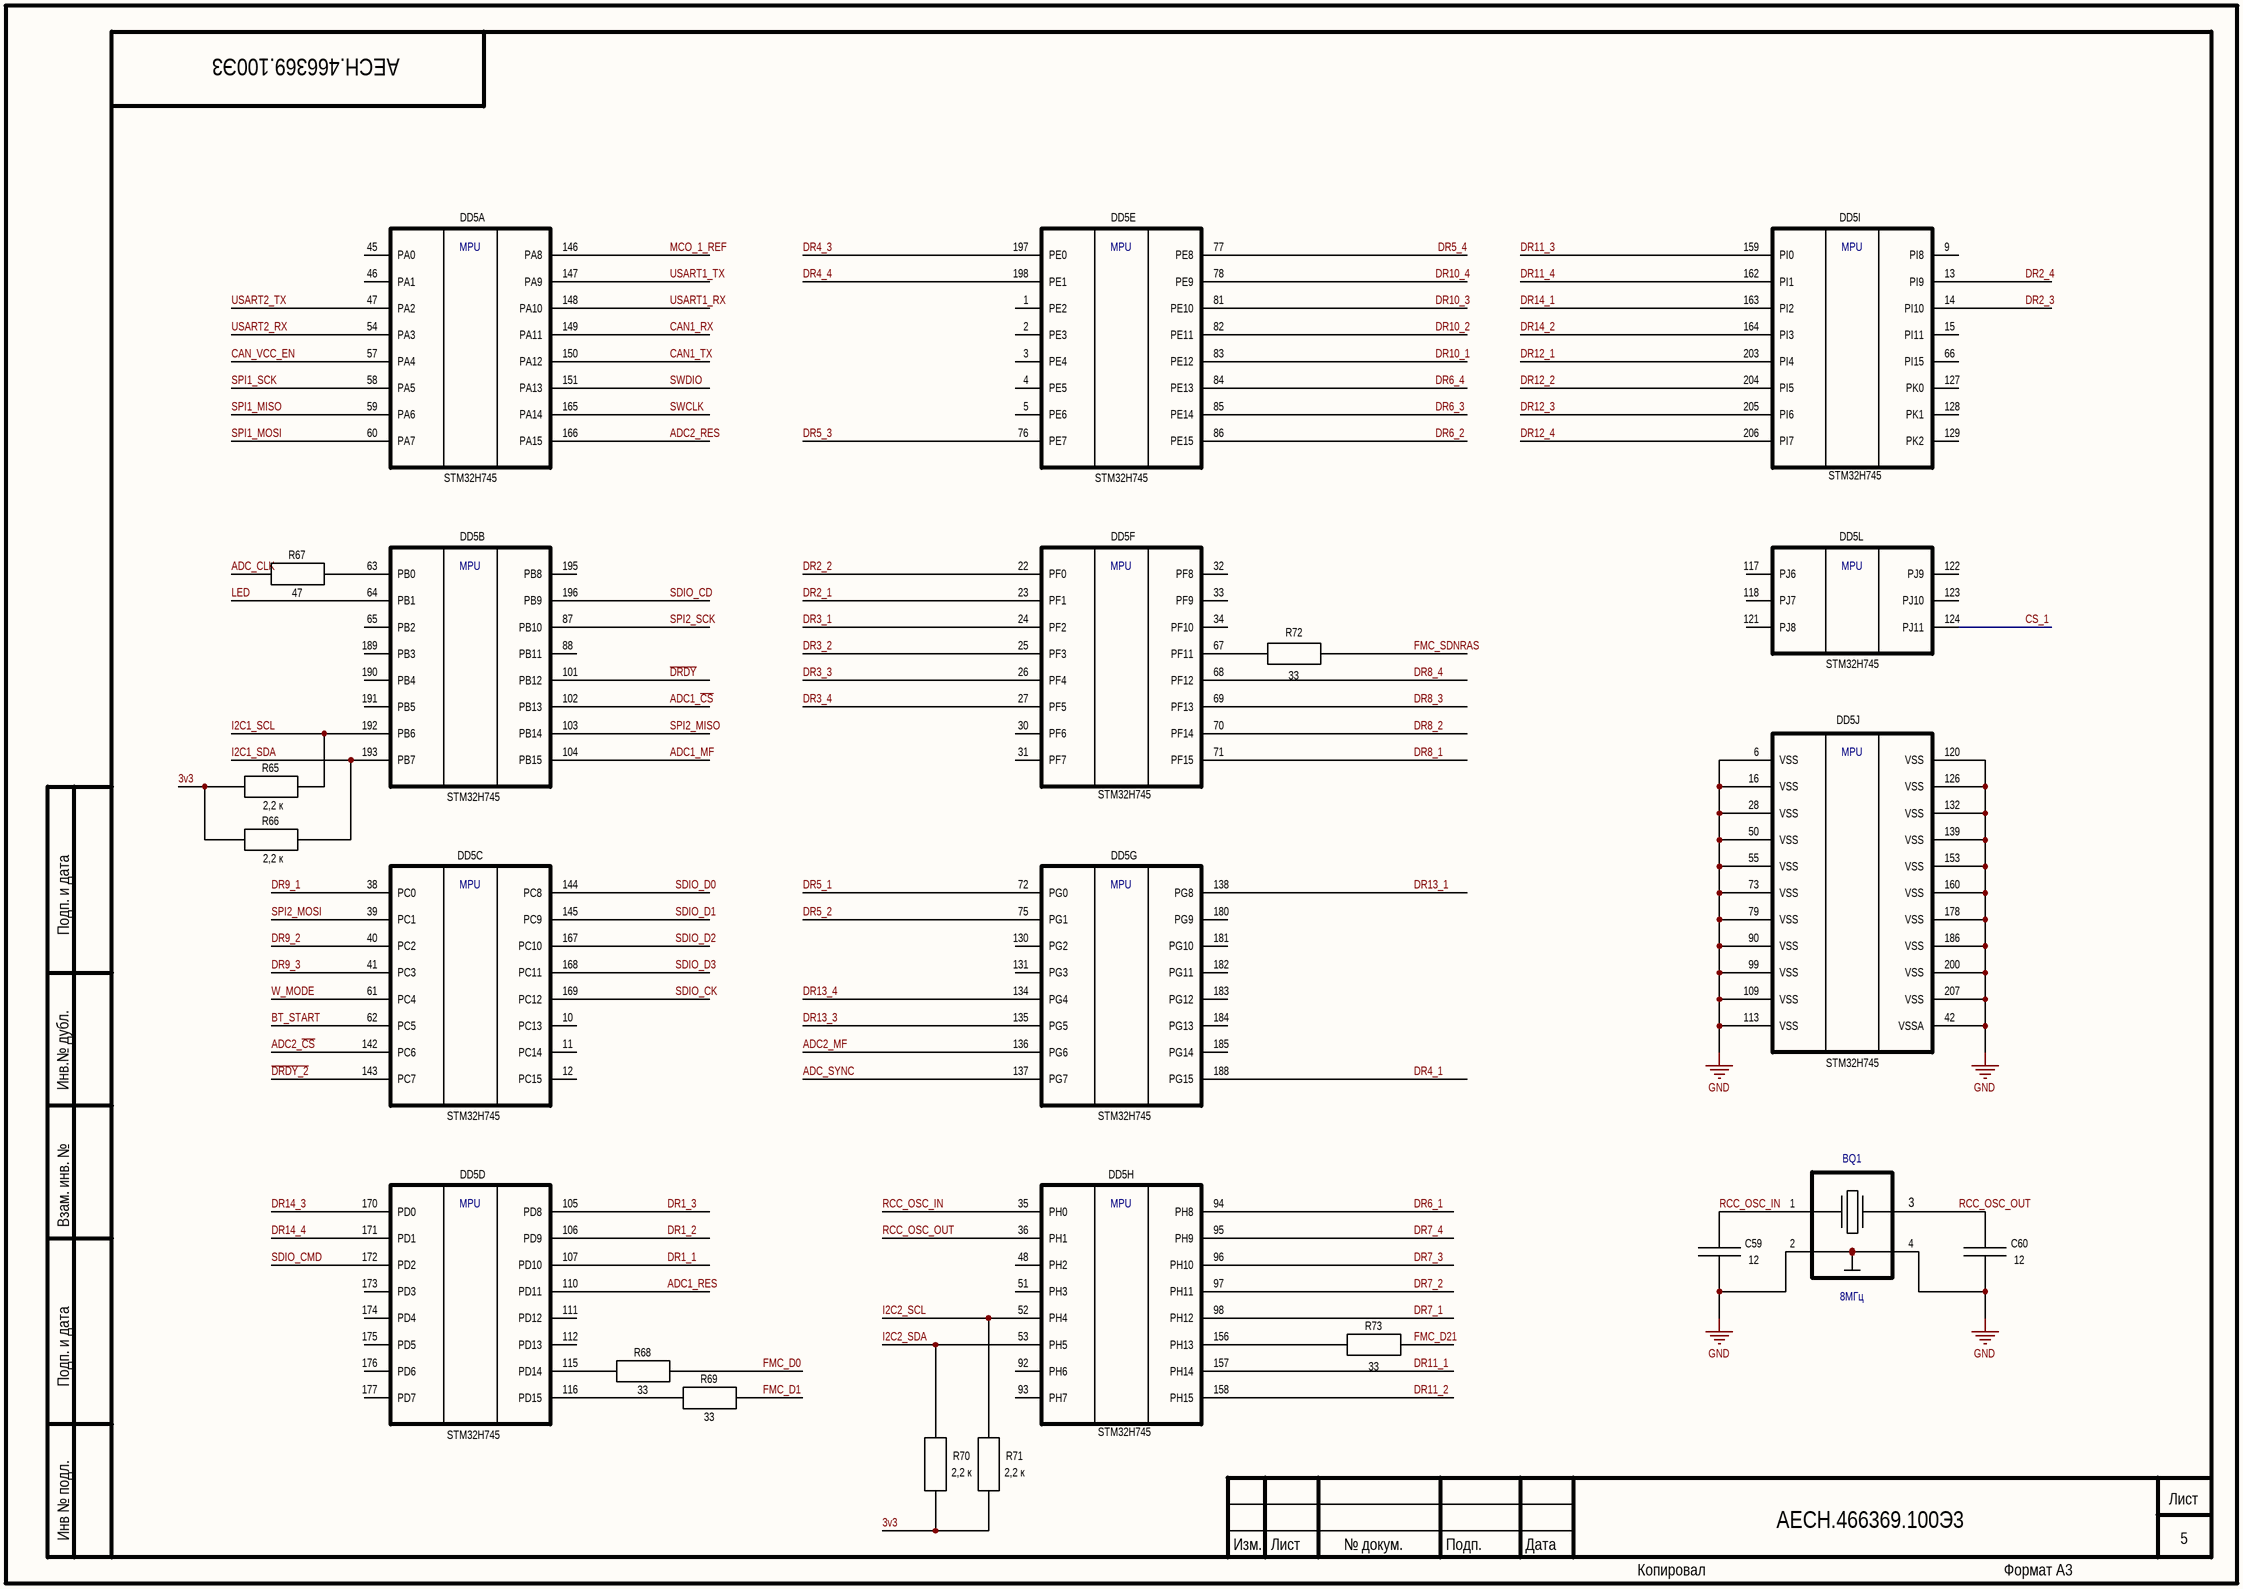
[diagram p4: MCU_1.SchDoc]

### Parts
BQ1  8МГц  [Crystal_0532]
C59  value 12  [C0603]  (hidden comment: C)
C60  value 12  [C0603]  (hidden comment: C)
DD5  STM32H745  [LQFP208]  (parts A,B,C,D,E,F,G,H,I,J,L of 13)
R65  value 2,2 к  [R0603]  (hidden comment: R)
R66  value 2,2 к  [R0603]  (hidden comment: R)
R67  value 47  [R0603]  (hidden comment: R)
R68  value 33  [R0603]  (hidden comment: R)
R69  value 33  [R0603]  (hidden comment: R)
R70  value 2,2 к  [R0603]  (hidden comment: R)
R71  value 2,2 к  [R0603]  (hidden comment: R)
R72  value 33  [R0603]  (hidden comment: R)
R73  value 33  [R0603]  (hidden comment: R)

### Nets
GND: BQ1.2 BQ1.4 C59.2 C60.2 DD5.6(VSS) DD5.16(VSS) DD5.28(VSS) DD5.42(VSSA) DD5.50(VSS) DD5.55(VSS) DD5.73(VSS) DD5.79(VSS) DD5.90(VSS) DD5.99(VSS) DD5.109(VSS) DD5.113(VSS) DD5.120(VSS) DD5.126(VSS) DD5.132(VSS) DD5.139(VSS) DD5.153(VSS) DD5.160(VSS) DD5.178(VSS) DD5.186(VSS) DD5.200(VSS) DD5.207(VSS)
3v3: R65.2 R66.2 R70.2 R71.2
ADC1_~{CS}: DD5.102(PB13)
ADC1_MF: DD5.104(PB15)
ADC1_RES: DD5.110(PD11)
ADC2_~{CS}: DD5.142(PC6)
ADC2_MF: DD5.136(PG6)
ADC2_RES: DD5.166(PA15)
ADC_CLK: R67.1
ADC_SYNC: DD5.137(PG7)
BT_START: DD5.62(PC5)
CAN1_RX: DD5.149(PA11)
CAN1_TX: DD5.150(PA12)
CAN_VCC_EN: DD5.57(PA4)
CS_1: DD5.124(PJ11)
~{DRDY}: DD5.101(PB12)
~{DRDY_2}: DD5.143(PC7)
DR1_1: DD5.107(PD10)
DR1_2: DD5.106(PD9)
DR1_3: DD5.105(PD8)
DR2_1: DD5.23(PF1)
DR2_2: DD5.22(PF0)
DR2_3: DD5.14(PI10)
DR2_4: DD5.13(PI9)
DR3_1: DD5.24(PF2)
DR3_2: DD5.25(PF3)
DR3_3: DD5.26(PF4)
DR3_4: DD5.27(PF5)
DR4_1: DD5.188(PG15)
DR4_3: DD5.197(PE0)
DR4_4: DD5.198(PE1)
DR5_1: DD5.72(PG0)
DR5_2: DD5.75(PG1)
DR5_3: DD5.76(PE7)
DR5_4: DD5.77(PE8)
DR6_1: DD5.94(PH8)
DR6_2: DD5.86(PE15)
DR6_3: DD5.85(PE14)
DR6_4: DD5.84(PE13)
DR7_1: DD5.98(PH12)
DR7_2: DD5.97(PH11)
DR7_3: DD5.96(PH10)
DR7_4: DD5.95(PH9)
DR8_1: DD5.71(PF15)
DR8_2: DD5.70(PF14)
DR8_3: DD5.69(PF13)
DR8_4: DD5.68(PF12)
DR9_1: DD5.38(PC0)
DR9_2: DD5.40(PC2)
DR9_3: DD5.41(PC3)
DR10_1: DD5.83(PE12)
DR10_2: DD5.82(PE11)
DR10_3: DD5.81(PE10)
DR10_4: DD5.78(PE9)
DR11_1: DD5.157(PH14)
DR11_2: DD5.158(PH15)
DR11_3: DD5.159(PI0)
DR11_4: DD5.162(PI1)
DR12_1: DD5.203(PI4)
DR12_2: DD5.204(PI5)
DR12_3: DD5.205(PI6)
DR12_4: DD5.206(PI7)
DR13_1: DD5.138(PG8)
DR13_3: DD5.135(PG5)
DR13_4: DD5.134(PG4)
DR14_1: DD5.163(PI2)
DR14_2: DD5.164(PI3)
DR14_3: DD5.170(PD0)
DR14_4: DD5.171(PD1)
FMC_D0: R68.1
FMC_D1: R69.1
FMC_D21: R73.1
FMC_SDNRAS: R72.1
I2C1_SCL: DD5.192(PB6) R65.1
I2C1_SDA: DD5.193(PB7) R66.1
I2C2_SCL: DD5.52(PH4) R71.1
I2C2_SDA: DD5.53(PH5) R70.1
LED: DD5.64(PB1)
MCO_1_REF: DD5.146(PA8)
RCC_OSC_IN: BQ1.1 C59.1 DD5.35(PH0)
RCC_OSC_OUT: BQ1.3 C60.1 DD5.36(PH1)
SDIO_CD: DD5.196(PB9)
SDIO_CK: DD5.169(PC12)
SDIO_CMD: DD5.172(PD2)
SDIO_D0: DD5.144(PC8)
SDIO_D1: DD5.145(PC9)
SDIO_D2: DD5.167(PC10)
SDIO_D3: DD5.168(PC11)
SPI1_MISO: DD5.59(PA6)
SPI1_MOSI: DD5.60(PA7)
SPI1_SCK: DD5.58(PA5)
SPI2_MISO: DD5.103(PB14)
SPI2_MOSI: DD5.39(PC1)
SPI2_SCK: DD5.87(PB10)
SWCLK: DD5.165(PA14)
SWDIO: DD5.151(PA13)
USART1_RX: DD5.148(PA10)
USART1_TX: DD5.147(PA9)
USART2_RX: DD5.54(PA3)
USART2_TX: DD5.47(PA2)
W_MODE: DD5.61(PC4)
NetDD5_63: DD5.63(PB0) R67.2
NetDD5_67: DD5.67(PF11) R72.2
NetDD5_115: DD5.115(PD14) R68.2
NetDD5_116: DD5.116(PD15) R69.2
NetDD5_156: DD5.156(PH13) R73.2

Not connected (* = marked no-connect by the designer): DD5 1(PE2) 2(PE3) 3(PE4) 4(PE5) 5(PE6) 9(PI8) 10(PC13) 11(PC14) 12(PC15) 15(PI11) 30(PF6) 31(PF7) 32(PF8) 33(PF9) 34(PF10) 45(PA0) 46(PA1) 48(PH2) 51(PH3) 65(PB2) 66(PI15) 88(PB11) 92(PH6) 93(PH7) 111(PD12) 112(PD13) 117(PJ6) 118(PJ7) 121(PJ8) 122(PJ9) 123(PJ10) 127(PK0) 128(PK1) 129(PK2) 130(PG2) 131(PG3) 173(PD3) 174(PD4) 175(PD5) 176(PD6) 177(PD7) 180(PG9) 181(PG10) 182(PG11) 183(PG12) 184(PG13) 185(PG14) 189(PB3) 190(PB4) 191(PB5) 195(PB8)

### Notes on the sheet
- Подп. и дата
- Инв.№ дубл.
- Взам. инв. №
- Инв № подл.
- Изм.
- Лист
- № докум.
- Подп.
- Дата
- Копировал
- Формат А3
- (in symbol STM32H745, part A) MPU
- (in symbol STM32H745, part B) MPU
- (in symbol STM32H745, part C) MPU
- (in symbol STM32H745, part D) MPU
- (in symbol STM32H745, part E) MPU
- (in symbol STM32H745, part F) MPU
- (in symbol STM32H745, part G) MPU
- (in symbol STM32H745, part H) MPU
- (in symbol STM32H745, part I) MPU
- (in symbol STM32H745, part J) MPU
- (in symbol STM32H745, part L) MPU

### Library data of the parts
BQ1 = OSC_4: PartNumber: KX-9AT 8.0 MHZ; Package: QSMD5.0x3.2x1.0; Value: 8МГц
C59 C60 = C: PartNumber: GRM1885C1H120JA01J; Tolerance: ±10%; Voltage: 50 В; Dielectric: NP0; Case: 0603; Mount: *
R65 R66 R70 R71 = R: PartNumber: RC0603JR-072K2L; Tolerance: ±5%; Power: 0.1 Вт; Case: 0603
R67 = R: as R1 on sheet ADC; Case: 0603
R68 R69 R72 R73 = R: PartNumber: RC0603JR-0733RL; Tolerance: ±5%; Power: 0.1 Вт; Case: 0603

## Sheet RES_ASSEMBLY.SchDoc
size 420 x 297 mm; DocumentNumber: АЕСН.466369.100Э3; SheetNumber: 6
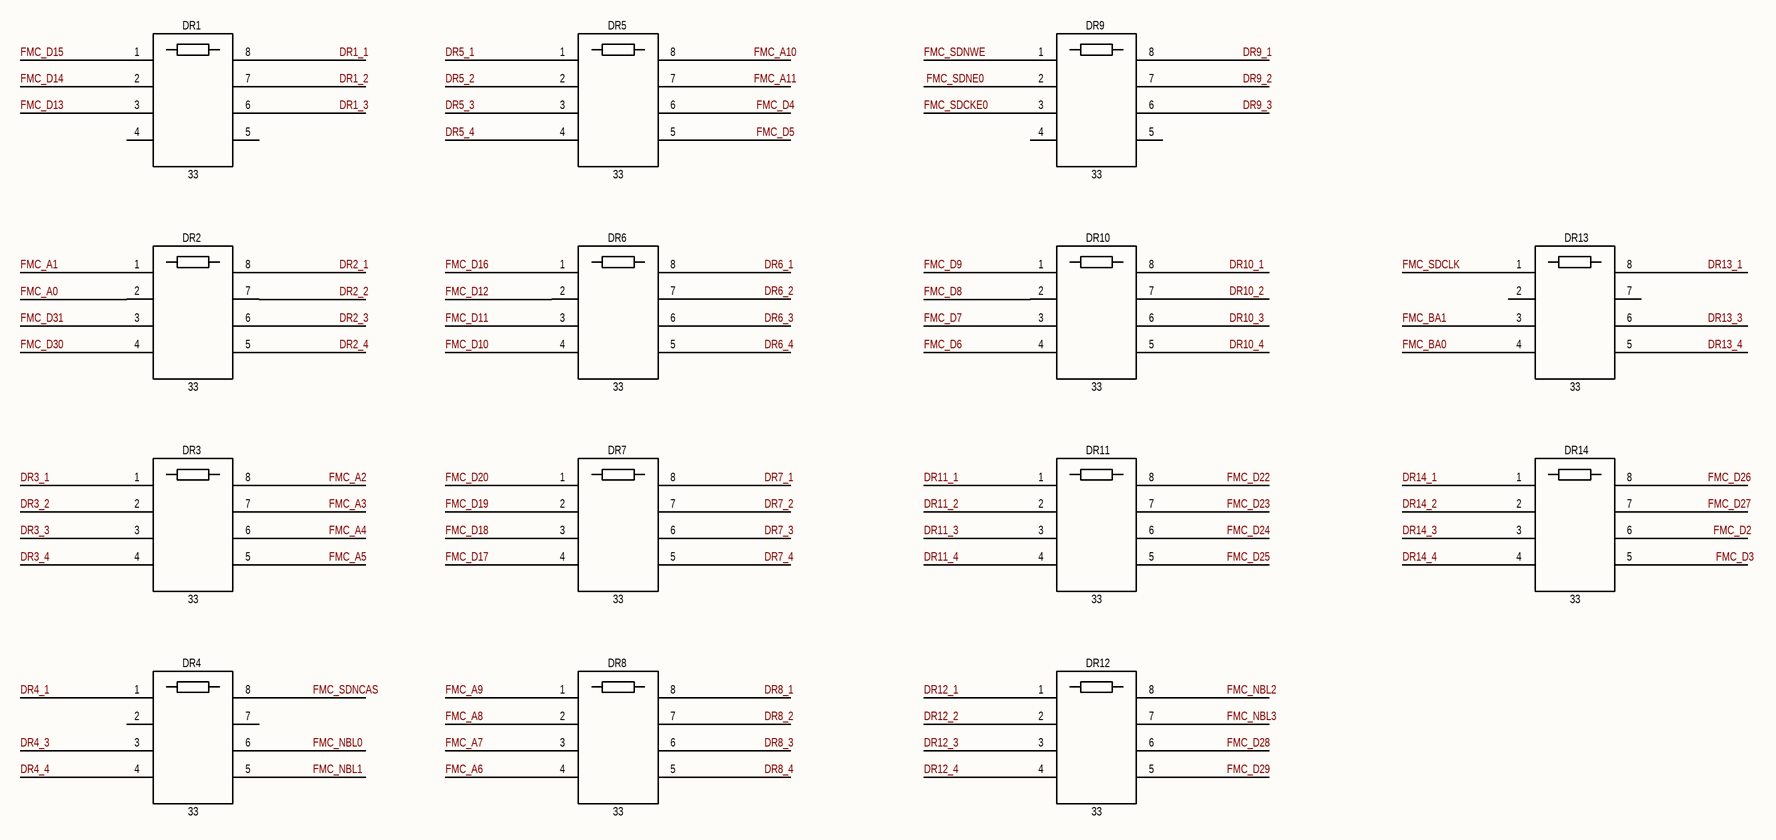
[diagram p5: RES_ASSEMBLY.SchDoc]

### Parts
DR1  33  [CAT16]
DR2  33  [CAT16]
DR3  33  [CAT16]
DR4  33  [CAT16]
DR5  33  [CAT16]
DR6  33  [CAT16]
DR7  33  [CAT16]
DR8  33  [CAT16]
DR9  33  [CAT16]
DR10  33  [CAT16]
DR11  33  [CAT16]
DR12  33  [CAT16]
DR13  33  [CAT16]
DR14  33  [CAT16]

### Nets
DR1_1: DR1.8
DR1_2: DR1.7
DR1_3: DR1.6
DR2_1: DR2.8
DR2_2: DR2.7
DR2_3: DR2.6
DR2_4: DR2.5
DR3_1: DR3.1
DR3_2: DR3.2
DR3_3: DR3.3
DR3_4: DR3.4
DR4_1: DR4.1
DR4_3: DR4.3
DR4_4: DR4.4
DR5_1: DR5.1
DR5_2: DR5.2
DR5_3: DR5.3
DR5_4: DR5.4
DR6_1: DR6.8
DR6_2: DR6.7
DR6_3: DR6.6
DR6_4: DR6.5
DR7_1: DR7.8
DR7_2: DR7.7
DR7_3: DR7.6
DR7_4: DR7.5
DR8_1: DR8.8
DR8_2: DR8.7
DR8_3: DR8.6
DR8_4: DR8.5
DR9_1: DR9.8
DR9_2: DR9.7
DR9_3: DR9.6
DR10_1: DR10.8
DR10_2: DR10.7
DR10_3: DR10.6
DR10_4: DR10.5
DR11_1: DR11.1
DR11_2: DR11.2
DR11_3: DR11.3
DR11_4: DR11.4
DR12_1: DR12.1
DR12_2: DR12.2
DR12_3: DR12.3
DR12_4: DR12.4
DR13_1: DR13.8
DR13_3: DR13.6
DR13_4: DR13.5
DR14_1: DR14.1
DR14_2: DR14.2
DR14_3: DR14.3
DR14_4: DR14.4
FMC_A0: DR2.2
FMC_A1: DR2.1
FMC_A2: DR3.8
FMC_A3: DR3.7
FMC_A4: DR3.6
FMC_A5: DR3.5
FMC_A6: DR8.4
FMC_A7: DR8.3
FMC_A8: DR8.2
FMC_A9: DR8.1
FMC_A10: DR5.8
FMC_A11: DR5.7
FMC_BA0: DR13.4
FMC_BA1: DR13.3
FMC_D2: DR14.6
FMC_D3: DR14.5
FMC_D4: DR5.6
FMC_D5: DR5.5
FMC_D6: DR10.4
FMC_D7: DR10.3
FMC_D8: DR10.2
FMC_D9: DR10.1
FMC_D10: DR6.4
FMC_D11: DR6.3
FMC_D12: DR6.2
FMC_D13: DR1.3
FMC_D14: DR1.2
FMC_D15: DR1.1
FMC_D16: DR6.1
FMC_D17: DR7.4
FMC_D18: DR7.3
FMC_D19: DR7.2
FMC_D20: DR7.1
FMC_D22: DR11.8
FMC_D23: DR11.7
FMC_D24: DR11.6
FMC_D25: DR11.5
FMC_D26: DR14.8
FMC_D27: DR14.7
FMC_D28: DR12.6
FMC_D29: DR12.5
FMC_D30: DR2.4
FMC_D31: DR2.3
FMC_NBL0: DR4.6
FMC_NBL1: DR4.5
FMC_NBL2: DR12.8
FMC_NBL3: DR12.7
FMC_SDCKE0: DR9.3
FMC_SDCLK: DR13.1
FMC_SDNCAS: DR4.8
FMC_SDNE0: DR9.2
FMC_SDNWE: DR9.1

Not connected (* = marked no-connect by the designer): DR1 4 5; DR4 2 7; DR9 4 5; DR13 2 7

### Notes on the sheet
- Подп. и дата
- Инв.№ дубл.
- Взам. инв. №
- Инв № подл.
- Изм.
- Лист
- № докум.
- Подп.
- Дата
- Копировал
- Формат А3

### Library data of the parts
DR1-DR14 = CAT16

## Sheet MCU_Power.SchDoc
size 420 x 297 mm; DocumentNumber: АЕСН.466369.100Э3; SheetNumber: 7; SheetTotal: x; DocumentName: Sheet1.SCHDOC
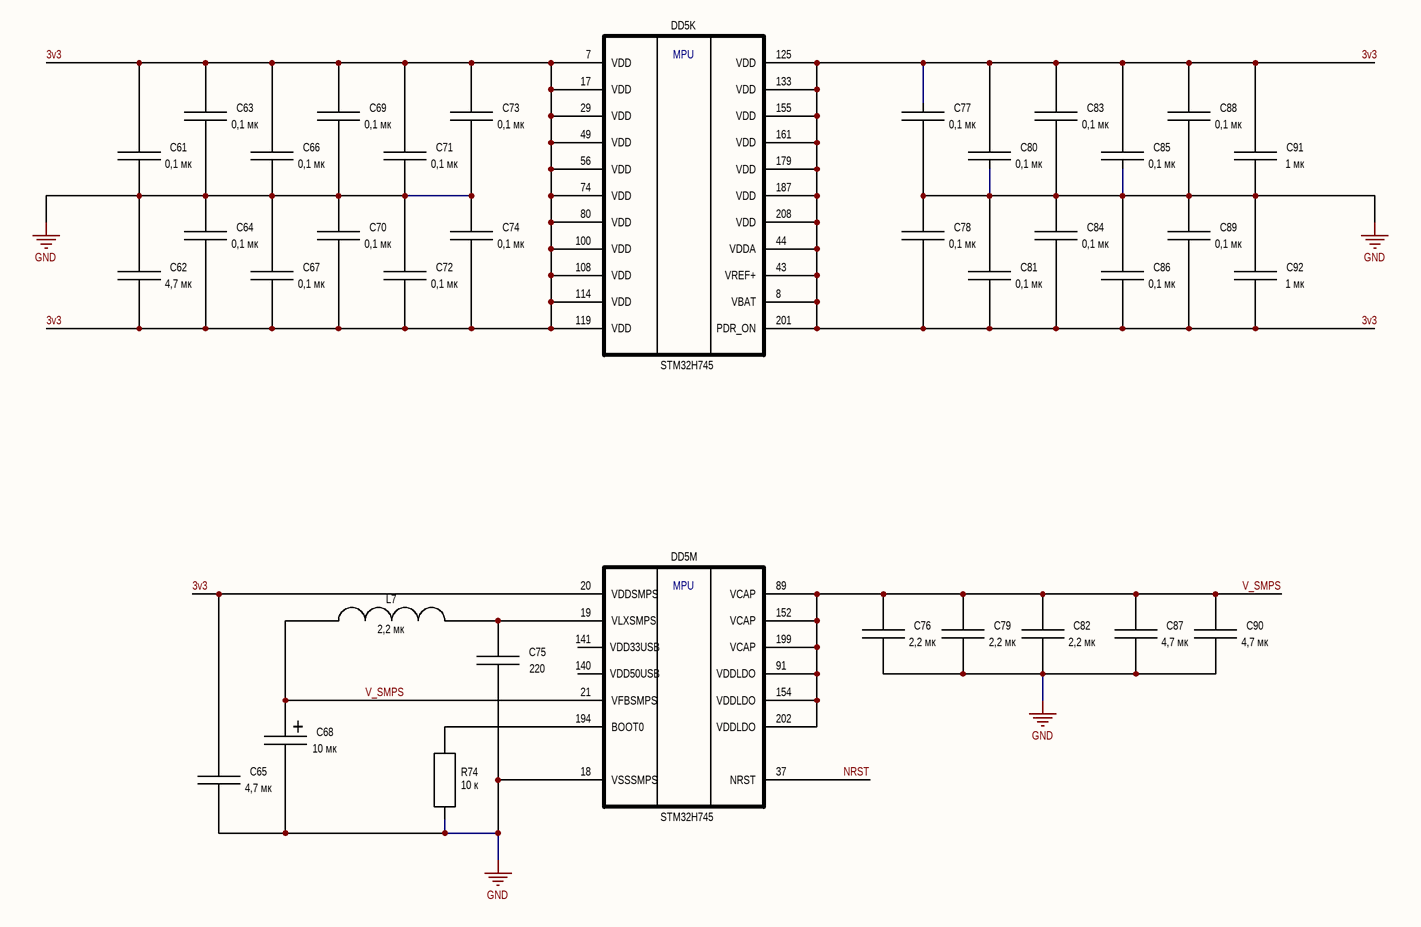
[diagram p6: MCU_Power.SchDoc]

### Parts
C61  value 0,1 мк  [C0603]  (hidden comment: C)
C62  value 4,7 мк  [C0603]  (hidden comment: C)
C63  value 0,1 мк  [C0603]  (hidden comment: C)
C64  value 0,1 мк  [C0603]  (hidden comment: C)
C65  value 4,7 мк  [C0603]  (hidden comment: C)
C66  value 0,1 мк  [C0603]  (hidden comment: C)
C67  value 0,1 мк  [C0603]  (hidden comment: C)
C68  value 10 мк  [Case A]  (hidden comment: C_el)
C69  value 0,1 мк  [C0603]  (hidden comment: C)
C70  value 0,1 мк  [C0603]  (hidden comment: C)
C71  value 0,1 мк  [C0603]  (hidden comment: C)
C72  value 0,1 мк  [C0603]  (hidden comment: C)
C73  value 0,1 мк  [C0603]  (hidden comment: C)
C74  value 0,1 мк  [C0603]  (hidden comment: C)
C75  value 220  [C0603]  (hidden comment: C)
C76  value 2,2 мк  [C0603]  (hidden comment: C)
C77  value 0,1 мк  [C0603]  (hidden comment: C)
C78  value 0,1 мк  [C0603]  (hidden comment: C)
C79  value 2,2 мк  [C0603]  (hidden comment: C)
C80  value 0,1 мк  [C0603]  (hidden comment: C)
C81  value 0,1 мк  [C0603]  (hidden comment: C)
C82  value 2,2 мк  [C0603]  (hidden comment: C)
C83  value 0,1 мк  [C0603]  (hidden comment: C)
C84  value 0,1 мк  [C0603]  (hidden comment: C)
C85  value 0,1 мк  [C0603]  (hidden comment: C)
C86  value 0,1 мк  [C0603]  (hidden comment: C)
C87  value 4,7 мк  [C0603]  (hidden comment: C)
C88  value 0,1 мк  [C0603]  (hidden comment: C)
C89  value 0,1 мк  [C0603]  (hidden comment: C)
C90  value 4,7 мк  [C0603]  (hidden comment: C)
C91  value 1 мк  [C0603]  (hidden comment: C)
C92  value 1 мк  [C0603]  (hidden comment: C)
DD5  STM32H745  [LQFP208]  (parts K,M of 13)
L7  2,2 мк  [INDC_0603]
R74  value 10 к  [R0603]  (hidden comment: R)

### Nets
GND: C61.2 C62.1 C63.2 C64.1 C65.2 C66.2 C67.1 C68.2 C69.2 C70.1 C71.2 C72.1 C73.2 C74.1 C75.2 C76.2 C77.2 C78.1 C79.2 C80.2 C81.1 C82.2 C83.2 C84.1 C85.2 C86.1 C87.2 C88.2 C89.1 C90.2 C91.2 C92.1 DD5.18(VSSSMPS) R74.1
3v3: C61.1 C62.2 C63.1 C64.2 C65.1 C66.1 C67.2 C69.1 C70.2 C71.1 C72.2 C73.1 C74.2 C77.1 C78.2 C80.1 C81.2 C83.1 C84.2 C85.1 C86.2 C88.1 C89.2 C91.1 C92.2 DD5.7(VDD) DD5.8(VBAT) DD5.17(VDD) DD5.20(VDDSMPS) DD5.29(VDD) DD5.43(VREF+) DD5.44(VDDA) DD5.49(VDD) DD5.56(VDD) DD5.74(VDD) DD5.80(VDD) DD5.100(VDD) DD5.108(VDD) DD5.114(VDD) DD5.119(VDD) DD5.125(VDD) DD5.133(VDD) DD5.155(VDD) DD5.161(VDD) DD5.179(VDD) DD5.187(VDD) DD5.201(PDR_ON) DD5.208(VDD)
NRST: DD5.37(NRST)
V_SMPS: C68.1 C76.1 C79.1 C82.1 C87.1 C90.1 DD5.21(VFBSMPS) DD5.89(VCAP) DD5.91(VDDLDO) DD5.152(VCAP) DD5.154(VDDLDO) DD5.199(VCAP) DD5.202(VDDLDO) L7.2
NetC75_1: C75.1 DD5.19(VLXSMPS) L7.1
NetDD5_194: DD5.194(BOOT0) R74.2

Not connected (* = marked no-connect by the designer): DD5 140(VDD50USB) 141(VDD33USB)

### Notes on the sheet
- Подп. и дата
- Инв.№ дубл.
- Взам. инв. №
- Инв № подл.
- Изм.
- Лист
- № докум.
- Подп.
- Дата
- Копировал
- Формат А3
- (in symbol C_el) +
- (in symbol STM32H745, part K) MPU
- (in symbol STM32H745, part M) MPU

### Library data of the parts
C61 C63 C64 C66 C67 C69-C74 C77 C78 C80 C81 C83-C86 C88 C89 = C: as C1 on sheet ADC; Case: 0603; Mount: *
C62 C65 C87 C90 = C: as C15 on sheet ADC; Case: 0603; Mount: *
C68 = C_el: as C29 on sheet ADC; Dielectric: *; Case: "A"; Mount: *
C75 = C: PartNumber: GCM1885C2A221JA16D; Tolerance: ±5%; Voltage: 100 В; Dielectric: NP0; Case: 0603; Mount: *
C76 C79 C82 = C: PartNumber: GRM188R71A225KE15J; Tolerance: ±10%; Voltage: 10 В; Dielectric: X7R; Case: 0603; Mount: *
C91 C92 = C: as C9 on sheet ADC; Case: 0603; Mount: *
L7 = L_1: PartNumber: MLZ1608A2R2WT000
R74 = R: as R4 on sheet ADC; Case: 0603

## Nets that join several sheets
AGND: ADC (28 pins), Connectors (L3.2 L4.2 L5.2 L6.2)
GND: ADC (6 pins), Connectors (5 pins), OTHER (19 pins), SDRAM (28 pins), MCU_1 (26 pins), MCU_Power (34 pins)
GND_EXT: Connectors (XP1.4), OTHER (11 pins)
3v3: ADC (15 pins), Connectors (R31.1 XS1.2), OTHER (18 pins), SDRAM (28 pins), MCU_1 (R65.2 R66.2 R70.2 R71.2), MCU_Power (48 pins)
3v3_EXT: Connectors (XP1.3), OTHER (10 pins)
4V: ADC (7 pins), Connectors (X19.1 XS1.5 XS1.6)
ADC1_~{CS}: ADC (R12.1), MCU_1 (DD5.102)
ADC1_INN1: ADC (D1.13 R19.1), Connectors (X1.1)
ADC1_INN2: ADC (D1.11 R20.1), Connectors (X4.1)
ADC1_INP2: ADC (C11.1 D1.10 R24.1 R24.2), Connectors (X3.1)
ADC1_MF: ADC (R14.1), MCU_1 (DD5.104)
ADC1_RES: ADC (D1.19 R4.2), MCU_1 (DD5.110)
ADC2_~{CS}: ADC (R16.1), MCU_1 (DD5.142)
ADC2_INN1: ADC (D2.13 R21.1), Connectors (X7.1)
ADC2_INN2: ADC (D2.11 R22.1), Connectors (X10.1)
ADC2_INP2: ADC (C12.1 D2.10 R26.1 R26.2), Connectors (X9.1)
ADC2_MF: ADC (R18.1), MCU_1 (DD5.136)
ADC2_RES: ADC (D2.19 R9.2), MCU_1 (DD5.166)
ADC_CLK: ADC (D1.23 D2.23), MCU_1 (R67.1)
ADC_SYNC: ADC (R5.1 R10.1), MCU_1 (DD5.137)
BAT-: ADC (C15.1 C16.1 DA1.5 DA1.8), Connectors (XS1.4)
BT_START: Connectors (XS1.13), OTHER (R64.2 SA2.1), MCU_1 (DD5.62)
CAN1_RX: OTHER (DD2.4), MCU_1 (DD5.149)
CAN1_TX: OTHER (DD2.1), MCU_1 (DD5.150)
CAN_H: Connectors (XS1.12), OTHER (DD2.7 R48.1 VD4.1)
CAN_L: Connectors (XS1.11), OTHER (DD2.6 R48.2 VD4.2)
CAN_VCC_EN: OTHER (DD2.5), MCU_1 (DD5.57)
CS_1: Connectors (X17.1), MCU_1 (DD5.124)
~{DRDY}: ADC (R1.1), MCU_1 (DD5.101)
~{DRDY_2}: ADC (R6.1), MCU_1 (DD5.143)
DR1_1: MCU_1 (DD5.107), RES_ASSEMBLY (DR1.8)
DR1_2: MCU_1 (DD5.106), RES_ASSEMBLY (DR1.7)
DR1_3: MCU_1 (DD5.105), RES_ASSEMBLY (DR1.6)
DR2_1: MCU_1 (DD5.23), RES_ASSEMBLY (DR2.8)
DR2_2: MCU_1 (DD5.22), RES_ASSEMBLY (DR2.7)
DR2_3: MCU_1 (DD5.14), RES_ASSEMBLY (DR2.6)
DR2_4: MCU_1 (DD5.13), RES_ASSEMBLY (DR2.5)
DR3_1: MCU_1 (DD5.24), RES_ASSEMBLY (DR3.1)
DR3_2: MCU_1 (DD5.25), RES_ASSEMBLY (DR3.2)
DR3_3: MCU_1 (DD5.26), RES_ASSEMBLY (DR3.3)
DR3_4: MCU_1 (DD5.27), RES_ASSEMBLY (DR3.4)
DR4_1: MCU_1 (DD5.188), RES_ASSEMBLY (DR4.1)
DR4_3: MCU_1 (DD5.197), RES_ASSEMBLY (DR4.3)
DR4_4: MCU_1 (DD5.198), RES_ASSEMBLY (DR4.4)
DR5_1: MCU_1 (DD5.72), RES_ASSEMBLY (DR5.1)
DR5_2: MCU_1 (DD5.75), RES_ASSEMBLY (DR5.2)
DR5_3: MCU_1 (DD5.76), RES_ASSEMBLY (DR5.3)
DR5_4: MCU_1 (DD5.77), RES_ASSEMBLY (DR5.4)
DR6_1: MCU_1 (DD5.94), RES_ASSEMBLY (DR6.8)
DR6_2: MCU_1 (DD5.86), RES_ASSEMBLY (DR6.7)
DR6_3: MCU_1 (DD5.85), RES_ASSEMBLY (DR6.6)
DR6_4: MCU_1 (DD5.84), RES_ASSEMBLY (DR6.5)
DR7_1: MCU_1 (DD5.98), RES_ASSEMBLY (DR7.8)
DR7_2: MCU_1 (DD5.97), RES_ASSEMBLY (DR7.7)
DR7_3: MCU_1 (DD5.96), RES_ASSEMBLY (DR7.6)
DR7_4: MCU_1 (DD5.95), RES_ASSEMBLY (DR7.5)
DR8_1: MCU_1 (DD5.71), RES_ASSEMBLY (DR8.8)
DR8_2: MCU_1 (DD5.70), RES_ASSEMBLY (DR8.7)
DR8_3: MCU_1 (DD5.69), RES_ASSEMBLY (DR8.6)
DR8_4: MCU_1 (DD5.68), RES_ASSEMBLY (DR8.5)
DR9_1: MCU_1 (DD5.38), RES_ASSEMBLY (DR9.8)
DR9_2: MCU_1 (DD5.40), RES_ASSEMBLY (DR9.7)
DR9_3: MCU_1 (DD5.41), RES_ASSEMBLY (DR9.6)
DR10_1: MCU_1 (DD5.83), RES_ASSEMBLY (DR10.8)
DR10_2: MCU_1 (DD5.82), RES_ASSEMBLY (DR10.7)
DR10_3: MCU_1 (DD5.81), RES_ASSEMBLY (DR10.6)
DR10_4: MCU_1 (DD5.78), RES_ASSEMBLY (DR10.5)
DR11_1: MCU_1 (DD5.157), RES_ASSEMBLY (DR11.1)
DR11_2: MCU_1 (DD5.158), RES_ASSEMBLY (DR11.2)
DR11_3: MCU_1 (DD5.159), RES_ASSEMBLY (DR11.3)
DR11_4: MCU_1 (DD5.162), RES_ASSEMBLY (DR11.4)
DR12_1: MCU_1 (DD5.203), RES_ASSEMBLY (DR12.1)
DR12_2: MCU_1 (DD5.204), RES_ASSEMBLY (DR12.2)
DR12_3: MCU_1 (DD5.205), RES_ASSEMBLY (DR12.3)
DR12_4: MCU_1 (DD5.206), RES_ASSEMBLY (DR12.4)
DR13_1: MCU_1 (DD5.138), RES_ASSEMBLY (DR13.8)
DR13_3: MCU_1 (DD5.135), RES_ASSEMBLY (DR13.6)
DR13_4: MCU_1 (DD5.134), RES_ASSEMBLY (DR13.5)
DR14_1: MCU_1 (DD5.163), RES_ASSEMBLY (DR14.1)
DR14_2: MCU_1 (DD5.164), RES_ASSEMBLY (DR14.2)
DR14_3: MCU_1 (DD5.170), RES_ASSEMBLY (DR14.3)
DR14_4: MCU_1 (DD5.171), RES_ASSEMBLY (DR14.4)
FMC_A0: SDRAM (DD3.23 DD4.23), RES_ASSEMBLY (DR2.2)
FMC_A1: SDRAM (DD3.24 DD4.24), RES_ASSEMBLY (DR2.1)
FMC_A2: SDRAM (DD3.25 DD4.25), RES_ASSEMBLY (DR3.8)
FMC_A3: SDRAM (DD3.26 DD4.26), RES_ASSEMBLY (DR3.7)
FMC_A4: SDRAM (DD3.29 DD4.29), RES_ASSEMBLY (DR3.6)
FMC_A5: SDRAM (DD3.30 DD4.30), RES_ASSEMBLY (DR3.5)
FMC_A6: SDRAM (DD3.31 DD4.31), RES_ASSEMBLY (DR8.4)
FMC_A7: SDRAM (DD3.32 DD4.32), RES_ASSEMBLY (DR8.3)
FMC_A8: SDRAM (DD3.33 DD4.33), RES_ASSEMBLY (DR8.2)
FMC_A9: SDRAM (DD3.34 DD4.34), RES_ASSEMBLY (DR8.1)
FMC_A10: SDRAM (DD3.22 DD4.22), RES_ASSEMBLY (DR5.8)
FMC_A11: SDRAM (DD3.35 DD4.35), RES_ASSEMBLY (DR5.7)
FMC_BA0: SDRAM (DD3.20 DD4.20), RES_ASSEMBLY (DR13.4)
FMC_BA1: SDRAM (DD3.21 DD4.21), RES_ASSEMBLY (DR13.3)
FMC_D0: SDRAM (DD3.2), MCU_1 (R68.1)
FMC_D1: SDRAM (DD3.4), MCU_1 (R69.1)
FMC_D2: SDRAM (DD3.5), RES_ASSEMBLY (DR14.6)
FMC_D3: SDRAM (DD3.7), RES_ASSEMBLY (DR14.5)
FMC_D4: SDRAM (DD3.8), RES_ASSEMBLY (DR5.6)
FMC_D5: SDRAM (DD3.10), RES_ASSEMBLY (DR5.5)
FMC_D6: SDRAM (DD3.11), RES_ASSEMBLY (DR10.4)
FMC_D7: SDRAM (DD3.13), RES_ASSEMBLY (DR10.3)
FMC_D8: SDRAM (DD3.42), RES_ASSEMBLY (DR10.2)
FMC_D9: SDRAM (DD3.44), RES_ASSEMBLY (DR10.1)
FMC_D10: SDRAM (DD3.45), RES_ASSEMBLY (DR6.4)
FMC_D11: SDRAM (DD3.47), RES_ASSEMBLY (DR6.3)
FMC_D12: SDRAM (DD3.48), RES_ASSEMBLY (DR6.2)
FMC_D13: SDRAM (DD3.50), RES_ASSEMBLY (DR1.3)
FMC_D14: SDRAM (DD3.51), RES_ASSEMBLY (DR1.2)
FMC_D15: SDRAM (DD3.53), RES_ASSEMBLY (DR1.1)
FMC_D16: SDRAM (DD4.2), RES_ASSEMBLY (DR6.1)
FMC_D17: SDRAM (DD4.4), RES_ASSEMBLY (DR7.4)
FMC_D18: SDRAM (DD4.5), RES_ASSEMBLY (DR7.3)
FMC_D19: SDRAM (DD4.7), RES_ASSEMBLY (DR7.2)
FMC_D20: SDRAM (DD4.8), RES_ASSEMBLY (DR7.1)
FMC_D21: SDRAM (DD4.10), MCU_1 (R73.1)
FMC_D22: SDRAM (DD4.11), RES_ASSEMBLY (DR11.8)
FMC_D23: SDRAM (DD4.13), RES_ASSEMBLY (DR11.7)
FMC_D24: SDRAM (DD4.42), RES_ASSEMBLY (DR11.6)
FMC_D25: SDRAM (DD4.44), RES_ASSEMBLY (DR11.5)
FMC_D26: SDRAM (DD4.45), RES_ASSEMBLY (DR14.8)
FMC_D27: SDRAM (DD4.47), RES_ASSEMBLY (DR14.7)
FMC_D28: SDRAM (DD4.48), RES_ASSEMBLY (DR12.6)
FMC_D29: SDRAM (DD4.50), RES_ASSEMBLY (DR12.5)
FMC_D30: SDRAM (DD4.51), RES_ASSEMBLY (DR2.4)
FMC_D31: SDRAM (DD4.53), RES_ASSEMBLY (DR2.3)
FMC_NBL0: SDRAM (DD3.15), RES_ASSEMBLY (DR4.6)
FMC_NBL1: SDRAM (DD3.39), RES_ASSEMBLY (DR4.5)
FMC_NBL2: SDRAM (DD4.15), RES_ASSEMBLY (DR12.8)
FMC_NBL3: SDRAM (DD4.39), RES_ASSEMBLY (DR12.7)
FMC_SDCKE0: SDRAM (DD3.37 DD4.37), RES_ASSEMBLY (DR9.3)
FMC_SDCLK: SDRAM (DD3.38 DD4.38), RES_ASSEMBLY (DR13.1)
FMC_SDNCAS: SDRAM (DD3.17 DD4.17), RES_ASSEMBLY (DR4.8)
FMC_SDNE0: SDRAM (DD3.19 DD4.19), RES_ASSEMBLY (DR9.2)
FMC_SDNRAS: SDRAM (DD3.18 DD4.18), MCU_1 (R72.1)
FMC_SDNWE: SDRAM (DD3.16 DD4.16), RES_ASSEMBLY (DR9.1)
I2C1_SCL: OTHER (DD1.6), MCU_1 (DD5.192 R65.1)
I2C1_SDA: OTHER (DD1.5), MCU_1 (DD5.193 R66.1)
I2C2_SCL: Connectors (XS1.3), MCU_1 (DD5.52 R71.1)
I2C2_SDA: Connectors (XS1.1), MCU_1 (DD5.53 R70.1)
IF1: ADC (C13.1 D1.12 R23.1 R23.2), Connectors (X2.1 X20.1)
IF2: ADC (C14.1 D2.12 R25.1 R25.2), Connectors (X8.1 X21.1)
LED: Connectors (XS1.14), OTHER (R51.2), MCU_1 (DD5.64)
MCO_1_REF: Connectors (X16.1), MCU_1 (DD5.146)
NRST: OTHER (C42.1 R45.2 XP2.4), MCU_Power (DD5.37)
SDIO_CD: OTHER (R42.1 X22.9), MCU_1 (DD5.196)
SDIO_CK: OTHER (R40.1 X22.5), MCU_1 (DD5.169)
SDIO_CMD: OTHER (R39.1 X22.3), MCU_1 (DD5.172)
SDIO_D0: OTHER (VD3.2 X22.7), MCU_1 (DD5.144)
SDIO_D1: OTHER (R41.1 X22.8), MCU_1 (DD5.145)
SDIO_D2: OTHER (R35.1 X22.1), MCU_1 (DD5.167)
SDIO_D3: OTHER (R37.1 X22.2), MCU_1 (DD5.168)
SPI1_MISO: ADC (R11.1), MCU_1 (DD5.59)
SPI1_MOSI: ADC (R2.1), MCU_1 (DD5.60)
SPI1_SCK: ADC (R3.1), MCU_1 (DD5.58)
SPI2_MISO: ADC (R15.1), MCU_1 (DD5.103)
SPI2_MOSI: ADC (R7.1), Connectors (X15.1), MCU_1 (DD5.39)
SPI2_SCK: ADC (R8.1), Connectors (X14.1), MCU_1 (DD5.87)
SWCLK: OTHER (XP2.3), MCU_1 (DD5.165)
SWDIO: OTHER (XP2.2), MCU_1 (DD5.151)
U1_RX_ISO: Connectors (XP1.1), OTHER (D3.1 D4.3 R43.1)
U1_TX_ISO: Connectors (XP1.2), OTHER (D3.4 D4.2 R44.1)
USART1_RX: OTHER (R49.2), MCU_1 (DD5.148)
USART1_TX: OTHER (R46.2), MCU_1 (DD5.147)
USART2_RX: Connectors (X24.1), MCU_1 (DD5.54)
USART2_TX: Connectors (X23.1), MCU_1 (DD5.47)
W_MODE: Connectors (R31.2 SA1.2), MCU_1 (DD5.61)